# Altium project GSHT.PrjPCB
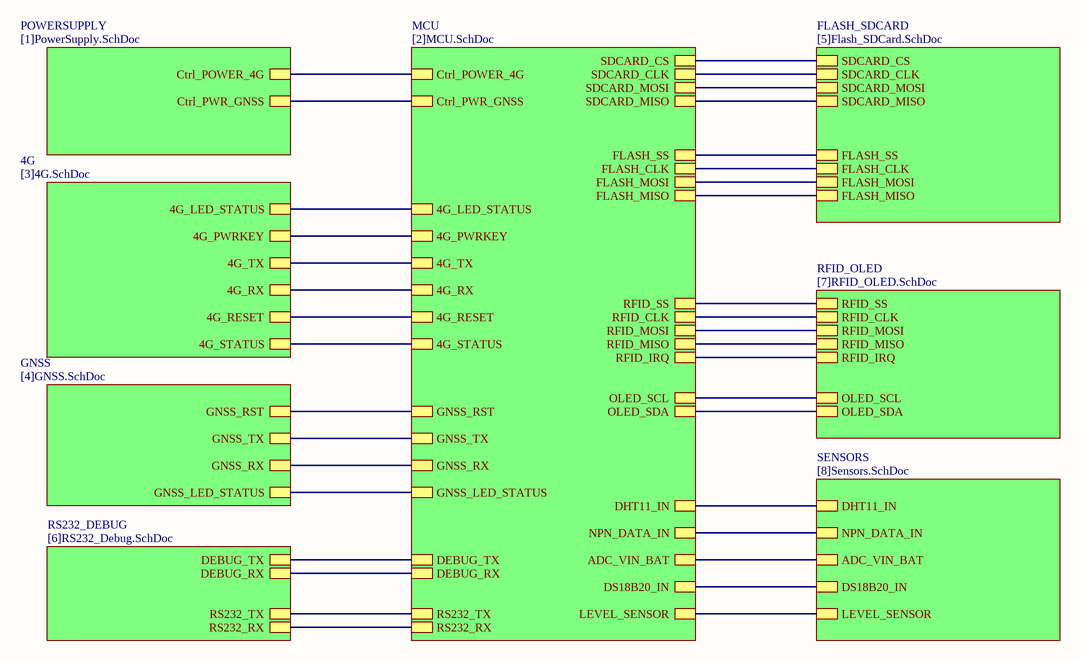
[diagram p0: MainSheet.SchDoc]
10 sheets, 215 parts. Net scope: hierarchical (ports join the sheet entries above them; power ports are global).
Board file: PCB_GSHT.PcbDoc
Sheets:
  MainSheet.SchDoc
    MCU = [2]MCU.SchDoc
    POWERSUPPLY = [1]PowerSupply.SchDoc
    4G = [3]4G.SchDoc
    GNSS = [4]GNSS.SchDoc
    FLASH_SDCARD = [5]Flash_SDCard.SchDoc
    RS232_DEBUG = [6]RS232_Debug.SchDoc
    RFID_OLED = [7]RFID_OLED.SchDoc
    SENSORS = [8]Sensors.SchDoc
  [0]Abstract.SchDoc

## Sheet MainSheet.SchDoc
size A

### Sub-sheets
4G = [3]4G.SchDoc: 4G_LED_STATUS, 4G_PWRKEY, 4G_TX, 4G_RX, 4G_RESET, 4G_STATUS
FLASH_SDCARD = [5]Flash_SDCard.SchDoc: SDCARD_CS, SDCARD_CLK, SDCARD_MISO, SDCARD_MOSI, FLASH_SS, FLASH_CLK, FLASH_MOSI, FLASH_MISO
GNSS = [4]GNSS.SchDoc: GNSS_RST, GNSS_TX, GNSS_RX, GNSS_LED_STATUS
MCU = [2]MCU.SchDoc: GNSS_LED_STATUS, 4G_LED_STATUS, GNSS_RST, GNSS_TX, GNSS_RX, 4G_TX, 4G_RX, 4G_STATUS, 4G_PWRKEY, RFID_IRQ, RS232_TX, RS232_RX, RFID_SS, RFID_CLK, RFID_MISO, RFID_MOSI, Ctrl_POWER_4G, Ctrl_PWR_GNSS, SDCARD_CS, DEBUG_TX, DEBUG_RX, SDCARD_CLK, SDCARD_MOSI, SDCARD_MISO, 4G_RESET, FLASH_SS, FLASH_CLK, FLASH_MOSI, FLASH_MISO, LEVEL_SENSOR, NPN_DATA_IN, ADC_VIN_BAT, DS18B20_IN, OLED_SCL, OLED_SDA, DHT11_IN
POWERSUPPLY = [1]PowerSupply.SchDoc: Ctrl_POWER_4G, Ctrl_PWR_GNSS
RFID_OLED = [7]RFID_OLED.SchDoc: RFID_SS, RFID_CLK, RFID_MOSI, RFID_MISO, RFID_IRQ, OLED_SCL, OLED_SDA
RS232_DEBUG = [6]RS232_Debug.SchDoc: RS232_TX, RS232_RX, DEBUG_TX, DEBUG_RX
SENSORS = [8]Sensors.SchDoc: NPN_DATA_IN, ADC_VIN_BAT, DS18B20_IN, LEVEL_SENSOR, DHT11_IN

### Nets
NetC39_1: sheet MCU/OLED_SDA, sheet RFID_OLED/OLED_SDA
NetC39_2: sheet MCU/OLED_SCL, sheet RFID_OLED/OLED_SCL
NetC70_1: sheet MCU/NPN_DATA_IN, sheet SENSORS/NPN_DATA_IN
NetC71_1: sheet MCU/ADC_VIN_BAT, sheet SENSORS/ADC_VIN_BAT
NetD3_1: sheet MCU/GNSS_LED_STATUS, sheet GNSS/GNSS_LED_STATUS
NetD3_3: sheet MCU/4G_LED_STATUS, sheet 4G/4G_LED_STATUS
NetIC4_1: sheet MCU/4G_TX, sheet 4G/4G_TX
NetIC4_8: sheet MCU/4G_RX, sheet 4G/4G_RX
NetIC6_2: sheet MCU/DS18B20_IN, sheet SENSORS/DS18B20_IN
NetJP1_1: sheet MCU/RFID_SS, sheet RFID_OLED/RFID_SS
NetJP1_2: sheet MCU/RFID_CLK, sheet RFID_OLED/RFID_CLK
NetJP1_3: sheet MCU/RFID_MOSI, sheet RFID_OLED/RFID_MOSI
NetJP1_4: sheet MCU/RFID_MISO, sheet RFID_OLED/RFID_MISO
NetJP1_5: sheet MCU/RFID_IRQ, sheet RFID_OLED/RFID_IRQ
NetJP3_2: sheet MCU/LEVEL_SENSOR, sheet SENSORS/LEVEL_SENSOR
NetJP4_2: sheet MCU/DHT11_IN, sheet SENSORS/DHT11_IN
NetLED5_2: sheet MCU/RS232_RX, sheet RS232_DEBUG/RS232_RX
NetLED6_2: sheet MCU/RS232_TX, sheet RS232_DEBUG/RS232_TX
NetLED7_2: sheet MCU/DEBUG_RX, sheet RS232_DEBUG/DEBUG_RX
NetLED8_2: sheet MCU/DEBUG_TX, sheet RS232_DEBUG/DEBUG_TX
NetR7_2: sheet MCU/Ctrl_POWER_4G, sheet POWERSUPPLY/Ctrl_POWER_4G
NetR11_2: sheet MCU/Ctrl_PWR_GNSS, sheet POWERSUPPLY/Ctrl_PWR_GNSS
NetR28_1: sheet MCU/4G_RESET, sheet 4G/4G_RESET
NetR34_1: sheet MCU/4G_PWRKEY, sheet 4G/4G_PWRKEY
NetR41_1: sheet MCU/GNSS_RST, sheet GNSS/GNSS_RST
NetR48_1: sheet MCU/SDCARD_CS, sheet FLASH_SDCARD/SDCARD_CS
NetR49_1: sheet MCU/SDCARD_MOSI, sheet FLASH_SDCARD/SDCARD_MOSI
NetR50_1: sheet MCU/SDCARD_CLK, sheet FLASH_SDCARD/SDCARD_CLK
NetR51_1: sheet MCU/SDCARD_MISO, sheet FLASH_SDCARD/SDCARD_MISO
NetR52_1: sheet MCU/FLASH_SS, sheet FLASH_SDCARD/FLASH_SS
NetR72_2: sheet MCU/4G_STATUS, sheet 4G/4G_STATUS
NetU3_34: sheet MCU/FLASH_CLK, sheet FLASH_SDCARD/FLASH_CLK
NetU3_35: sheet MCU/FLASH_MISO, sheet FLASH_SDCARD/FLASH_MISO
NetU3_36: sheet MCU/FLASH_MOSI, sheet FLASH_SDCARD/FLASH_MOSI
NetU3_51: sheet MCU/GNSS_TX, sheet GNSS/GNSS_TX
NetU3_52: sheet MCU/GNSS_RX, sheet GNSS/GNSS_RX

## Sheet [2]MCU.SchDoc
size A4
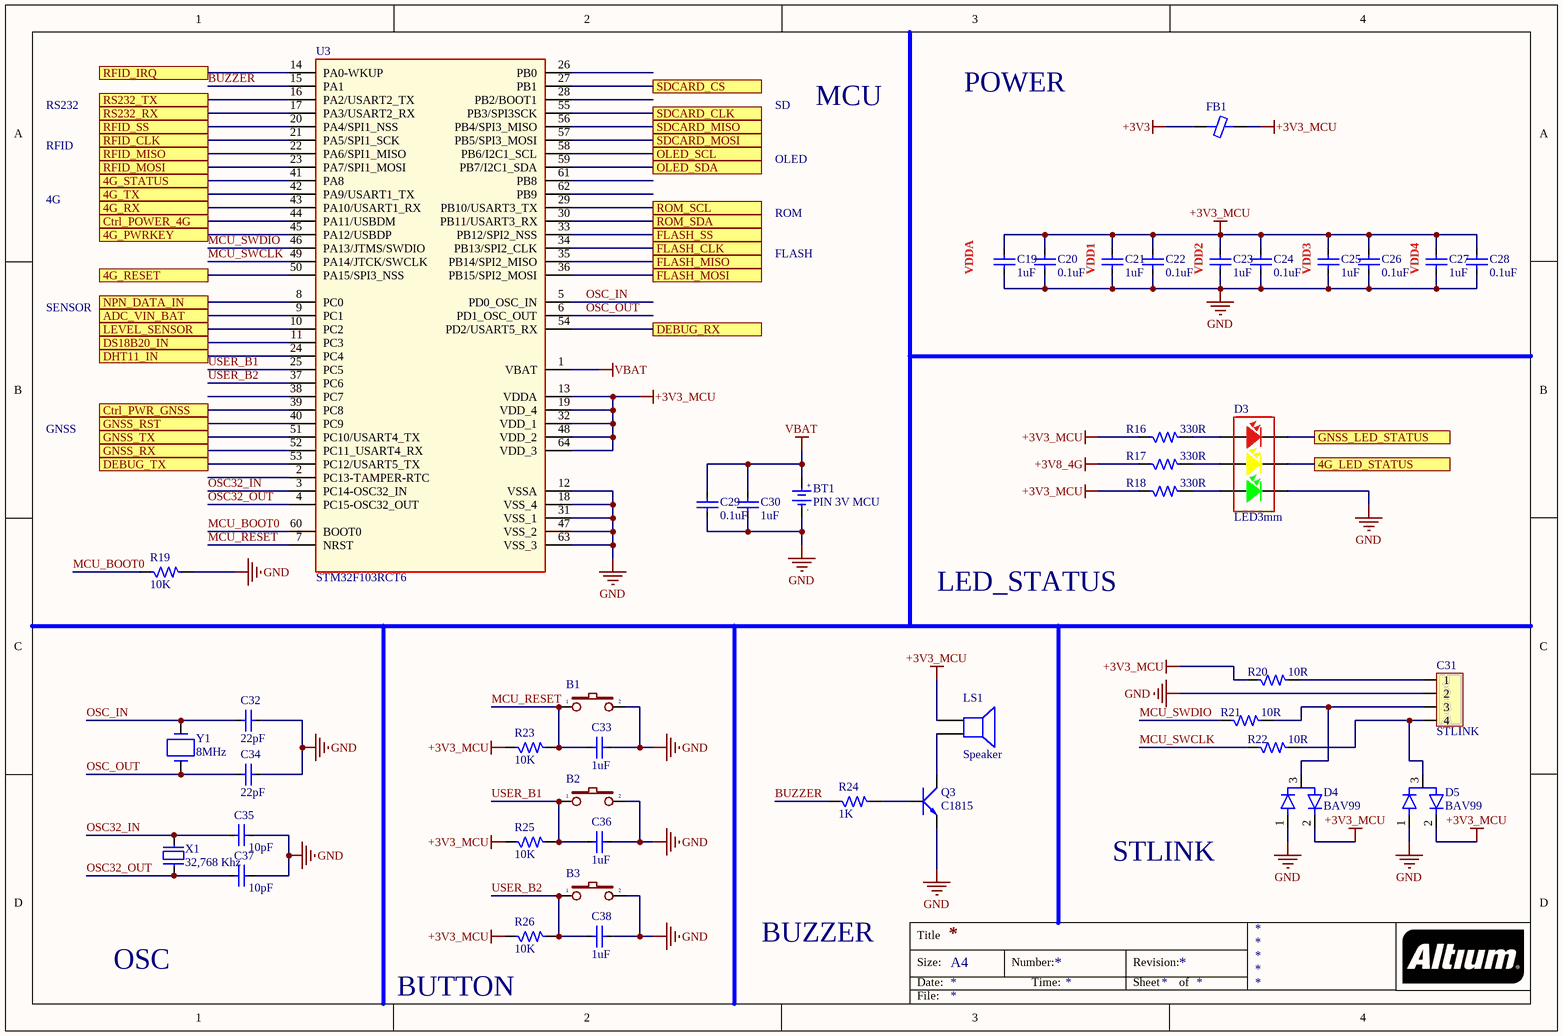
[diagram p1: [2]MCU.SchDoc]

### Parts
B1  Button 3x4x2.5  [Button 3x4x2.5]  (value not drawn)
B2  Button 3x4x2.5  [Button 3x4x2.5]  (value not drawn)
B3  Button 3x4x2.5  [Button 3x4x2.5]  (value not drawn)
BT1  PIN 3V MCU  [CR1220 SMD]
C19  1uF  [CAP_0805]
C20  0.1uF  [CAP_0805]
C21  1uF  [CAP_0805]
C22  0.1uF  [CAP_0805]
C23  1uF  [CAP_0805]
C24  0.1uF  [CAP_0805]
C25  1uF  [CAP_0805]
C26  0.1uF  [CAP_0805]
C27  1uF  [CAP_0805]
C28  0.1uF  [CAP_0805]
C29  0.1uF  [CAP_0805]
C30  1uF  [CAP_0805]
C31  STLINK  [CON_4P]
C32  22pF  [CAP_0805]
C33  1uF  [CAP_0805]
C34  22pF  [CAP_0805]
C35  10pF  [CAP_0805]
C36  1uF  [CAP_0805]
C37  10pF  [CAP_0805]
C38  1uF  [CAP_0805]
D3  LED3mm  [LED 3 holder 3mm]
D4  BAV99  [DIO_BAV99]
D5  BAV99  [DIO_BAV99]
FB1  120R  [RES-SMD-0805]  (value not drawn)
LS1  Speaker  [SPEAKER]
Q3  C1815  [SOT23B]
R16  330R  [R0805]
R17  330R  [R0805]
R18  330R  [R0805]
R19  10K  [R0805]
R20  10R  [R0805]
R21  10R  [R0805]
R22  10R  [R0805]
R23  10K  [R0805]
R24  1K  [R0805]
R25  10K  [R0805]
R26  10K  [R0805]
U3  STM32F103RCT6  [LQFP-64]
X1  32,768 Khz  [XT32kn]
Y1  8MHz  [ABM7_v1_1_BIG]

### Ports
4G_LED_STATUS, 4G_PWRKEY, 4G_RESET, 4G_RX, 4G_STATUS, 4G_TX, ADC_VIN_BAT, Ctrl_POWER_4G, Ctrl_PWR_GNSS, DEBUG_RX, DEBUG_TX, DHT11_IN, DS18B20_IN, FLASH_CLK, FLASH_MISO, FLASH_MOSI, FLASH_SS, GNSS_LED_STATUS, GNSS_RST, GNSS_RX, GNSS_TX, LEVEL_SENSOR, NPN_DATA_IN, OLED_SCL, OLED_SDA, RFID_CLK, RFID_IRQ, RFID_MISO, RFID_MOSI, RFID_SS, ROM_SCL, ROM_SDA, RS232_RX, RS232_TX, SDCARD_CLK, SDCARD_CS, SDCARD_MISO, SDCARD_MOSI

### Nets
+3V3: FB1.1
+3V3_MCU: C19.2 C20.2 C21.2 C22.2 C23.2 C24.2 C25.2 C26.2 C27.2 C28.2 D4.2 D5.2 FB1.2 LS1.1 R16.1 R18.1 R20.1 R23.1 R25.1 R26.1 U3.13(VDDA) U3.19(VDD_4) U3.32(VDD_1) U3.48(VDD_2) U3.64(VDD_3)
+3V8_4G: R17.1
GND: B1.2 B2.2 B3.2 BT1.2(GND) C19.1 C20.1 C21.1 C22.1 C23.1 C24.1 C25.1 C26.1 C27.1 C28.1 C29.1 C30.1 C31.2 C32.1 C33.1 C34.1 C35.1 C36.1 C37.1 C38.1 D3.5 D4.1 D5.1 Q3.1(E) R19.2 U3.12(VSSA) U3.18(VSS_4) U3.31(VSS_1) U3.47(VSS_2) U3.63(VSS_3)
VBAT: BT1.1(+3V) C29.2 C30.2 U3.1(VBAT)
BUZZER: R24.1 U3.15(PA1)
MCU_BOOT0: R19.1 U3.60(BOOT0)
MCU_RESET: B1.1 C33.2 R23.2 U3.7(NRST)
MCU_SWCLK: R22.1 U3.49(PA14/JTCK/SWCLK)
MCU_SWDIO: R21.1 U3.46(PA13/JTMS/SWDIO)
OSC32_IN: C35.2 U3.3(PC14-OSC32_IN) X1.1
OSC32_OUT: C37.2 U3.4(PC15-OSC32_OUT) X1.2
OSC_IN: C32.2 U3.5(PD0_OSC_IN) Y1.2
OSC_OUT: C34.2 U3.6(PD1_OSC_OUT) Y1.1
USER_B1: B2.1 C36.2 R25.2 U3.25(PC5)
USER_B2: B3.1 C38.2 R26.2 U3.37(PC6)
NetC31_1: C31.1 R20.2
NetC31_3: C31.3 D4.3 R21.2
NetC31_4: C31.4 D5.3 R22.2
NetC39_1: U3.59(PB7/I2C1_SDA) ; port OLED_SDA
NetC39_2: U3.58(PB6/I2C1_SCL) ; port OLED_SCL
NetC70_1: U3.8(PC0) ; port NPN_DATA_IN
NetC71_1: U3.9(PC1) ; port ADC_VIN_BAT
NetD3_1: D3.1 ; port GNSS_LED_STATUS
NetD3_2: D3.2 R16.2
NetD3_3: D3.3 ; port 4G_LED_STATUS
NetD3_4: D3.4 R17.2
NetD3_6: D3.6 R18.2
NetIC4_1: U3.42(PA9/USART1_TX) ; port 4G_TX
NetIC4_8: U3.43(PA10/USART1_RX) ; port 4G_RX
NetIC6_2: U3.11(PC3) ; port DS18B20_IN
NetJP1_1: U3.20(PA4/SPI1_NSS) ; port RFID_SS
NetJP1_2: U3.21(PA5/SPI1_SCK) ; port RFID_CLK
NetJP1_3: U3.23(PA7/SPI1_MOSI) ; port RFID_MOSI
NetJP1_4: U3.22(PA6/SPI1_MISO) ; port RFID_MISO
NetJP1_5: U3.14(PA0-WKUP) ; port RFID_IRQ
NetJP3_2: U3.10(PC2) ; port LEVEL_SENSOR
NetJP4_2: U3.24(PC4) ; port DHT11_IN
NetLED5_2: U3.17(PA3/USART2_RX) ; port RS232_RX
NetLED6_2: U3.16(PA2/USART2_TX) ; port RS232_TX
NetLED7_2: U3.54(PD2/USART5_RX) ; port DEBUG_RX
NetLED8_2: U3.53(PC12/USART5_TX) ; port DEBUG_TX
NetLS1_2: LS1.2 Q3.2(C)
NetQ3_3: Q3.3(B) R24.2
NetR7_2: U3.44(PA11/USBDM) ; port Ctrl_POWER_4G
NetR11_2: U3.39(PC8) ; port Ctrl_PWR_GNSS
NetR28_1: U3.50(PA15/SPI3_NSS) ; port 4G_RESET
NetR34_1: U3.45(PA12/USBDP) ; port 4G_PWRKEY
NetR41_1: U3.40(PC9) ; port GNSS_RST
NetR48_1: U3.27(PB1) ; port SDCARD_CS
NetR49_1: U3.57(PB5/SPI3_MOSI) ; port SDCARD_MOSI
NetR50_1: U3.55(PB3/SPI3SCK) ; port SDCARD_CLK
NetR51_1: U3.56(PB4/SPI3_MISO) ; port SDCARD_MISO
NetR52_1: U3.33(PB12/SPI2_NSS) ; port FLASH_SS
NetR72_2: U3.41(PA8) ; port 4G_STATUS
NetU3_29: U3.29(PB10/USART3_TX) ; port ROM_SCL
NetU3_30: U3.30(PB11/USART3_RX) ; port ROM_SDA
NetU3_34: U3.34(PB13/SPI2_CLK) ; port FLASH_CLK
NetU3_35: U3.35(PB14/SPI2_MISO) ; port FLASH_MISO
NetU3_36: U3.36(PB15/SPI2_MOSI) ; port FLASH_MOSI
NetU3_51: U3.51(PC10/USART4_TX) ; port GNSS_TX
NetU3_52: U3.52(PC11_USART4_RX) ; port GNSS_RX

Not connected (* = marked no-connect by the designer): U3 2(PC13-TAMPER-RTC) 26(PB0) 28(PB2/BOOT1) 38(PC7) 61(PB8) 62(PB9)

### Notes on the sheet
- RS232
- SD
- MCU
- POWER
- RFID
- OLED
- 4G
- ROM
- SENSOR
- FLASH
- (near C19) VDDA
- (near C21) VDD1
- (near C23) VDD2
- (near C25) VDD3
- (near C27) VDD4
- GNSS
- LED_STATUS
- STLINK
- OSC
- BUZZER
- (near R26) BUTTON
- Title
- Size:
- Date:
- A4
- Number:
- Time:
- Revision:
- Sheet
- of
- File:
- (in symbol PIN 3V) +; -

### Library data of the parts
B1-B3 = Button 3x4x2.5: pin to pad: 1>15 2>19
BT1 = PIN 3V: Battery 3VDC; Value: PIN 3V
C19-C30 C32-C38 = CapSMD: Capacitor; Value: 33p; Published: 8-Jun-2000; LatestRevisionDate: 17-Jul-2002; LatestRevisionNote: Re-released for DXP Platform.; PackageReference: RAD-0.3; Publisher: Altium Limited
C31 = Header4: Header IDC, 4 x 1 Pin Vertical 2.54mm Pitch (Non-Boxed, Male); Manufacturer: W¨¹rth Elektronik eiSos GmbH; partNo: 613002143121; ComponentLink1 Description: Manufacturer; ComponentLink2 Description: Datasheet; NoPins: 02; Created Date: 29 March 2013; ComponentLink1URL: http://www.we-online.com; ComponentLink2URL: http://katalog.we-online.de/em/datasheet/6130xx143121.pdf; Created by: Karrer Zheng
D3 = LED3Holder_3: LED 3 holder RGB 3mm; Value: LED 3 ly Single Colour
D4 D5 = BAV99: Diode Array 1 Pair Series Connection Standard 100V 215mA (DC) Surface Mount TO-236-3, SC-59, SOT-23-3; MF: ON Semiconductor; Price: None; Availability: In Stock; MP: BAV99; Package: SOT-23-3 Motorola; SnapEDA_Link: https://www.snapeda.com/parts/BAV99/Onsemi/view-part/?ref=snap; Check_prices: https://www.snapeda.com/parts/BAV99/Onsemi/view-part/?ref=eda; Value: *; Purchase-URL: https://pricing.snapeda.com/search/part/BAV99/?ref=eda
FB1 = Ferrite beads
LS1 = Speaker: Loudspeaker; Published: 24-Mar-1999; LatestRevisionDate: 17-Jul-2002; LatestRevisionNote: Re-released for DXP Platform.; PackageReference: PIN2; Publisher: Altium Limited
Q3 = C1815: NPN 600mW, ECB; Value: C1815
R16-R23 R25 R26 = RM: Resistor SMD; Value: 1K
R24 = RM: Resistor SMD; Value: 1K
U3 = STM32F103RCT6: MCU 32BIT 256KB FLASH 64LQFP
X1 = XT32k: Crystal 32,768kHz for timer real; Value: 32,768khz
Y1 = ABM7-16.000MHZ-D2Y-T: CRYSTAL 16MHZ 18PF SMD; Manufacturer: Abracon LLC; Frequency Stability: ±30ppm; Frequency Tolerance: ±20ppm; ESR (Equivalent Series Resistance): 50 Ohm; Operating Mode: Fundamental; .Creator: MM; .Checked PCB: RF; Supplier 1: Digi-Key; Manufacturer Part Number: ABM7-16.000MHZ-D2Y-T; RoHS: RoHS Compliant; Category: Crystals and Oscillators; Stock 1: 5861; Pricing 1: 1=0.96, 10=0.847, 50=0.791, 100=0.7, 500=0.6615 (USD); Packaging: Cut Tape (CT); Type: MHz Crystal; Frequency: 16MHz; Load Capacitance: 18pF; Operating Temperature: -40°C ~ 85°C; Ratings: -; Mounting Type: Surface Mount; Package / Case: 2-SMD; Size / Dimension: 0.236" L x 0.138" W (6.00mm x 3.50mm); Height: 0.055" (1.40mm); ComponentLink1URL: http://www.abracon.com/Resonators/abm7.pdf; ComponentLink1Description: http://www.abracon.com/Resonators/abm7.pdf; Supplier Part Number 1: 535-9840-1-ND; .Checked SCH: RF

## Sheet [1]PowerSupply.SchDoc
size A4
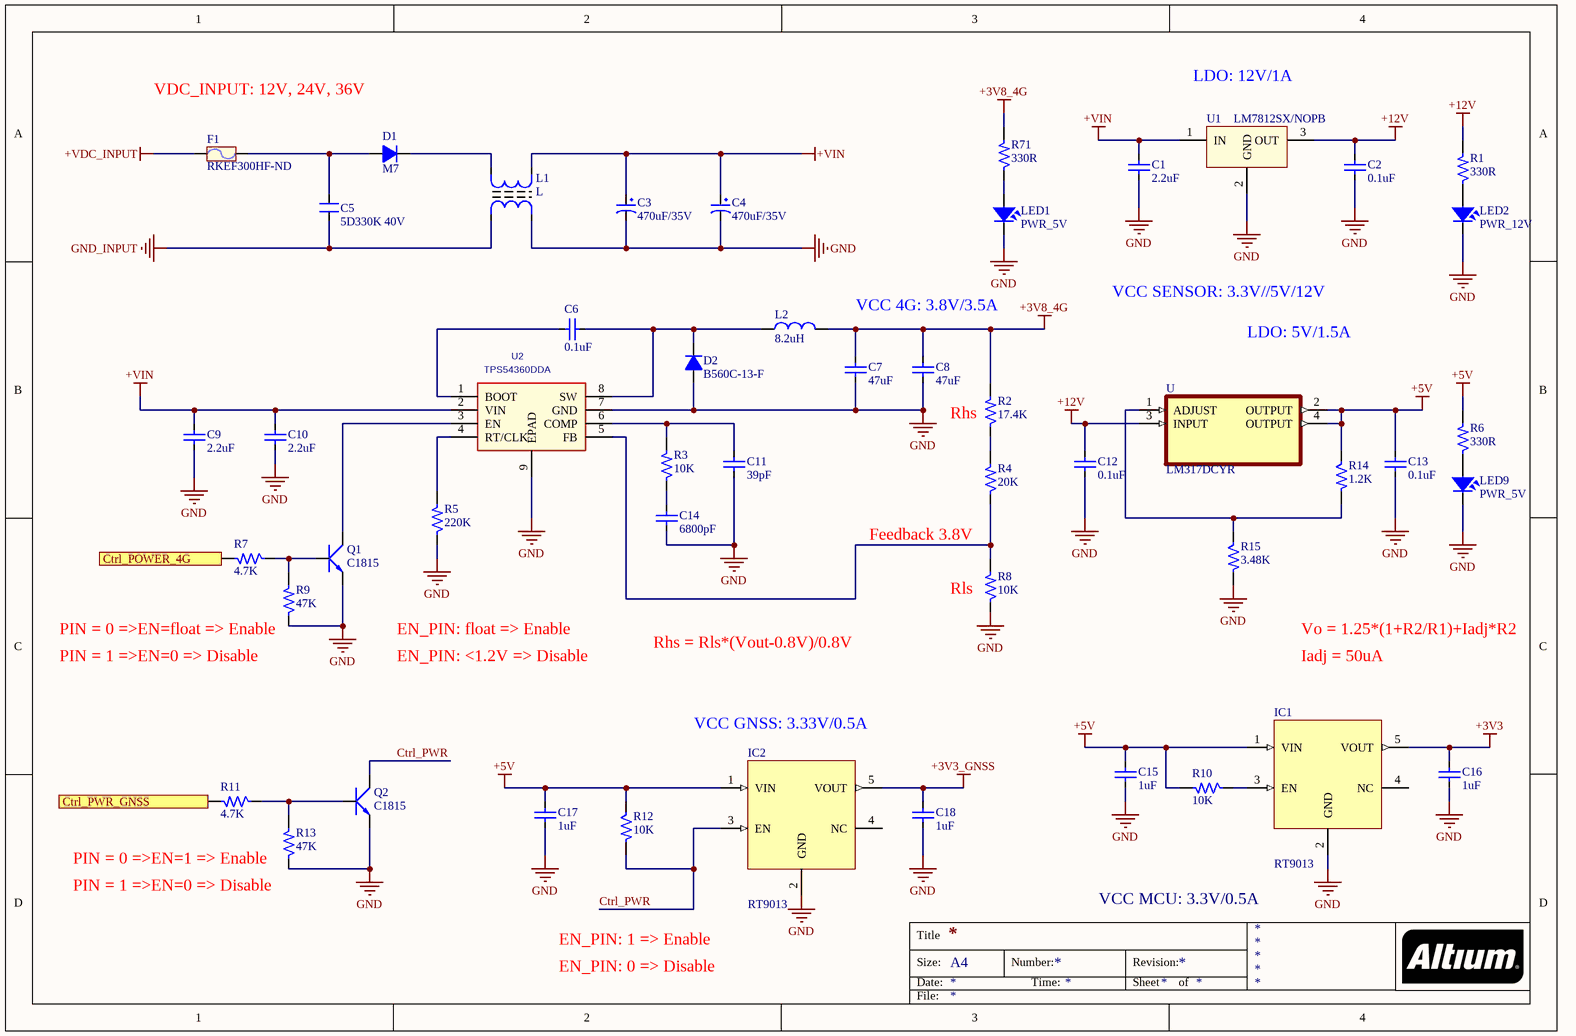
[diagram p2: [1]PowerSupply.SchDoc]

### Parts
C1  2.2uF  [CAP_0805]
C2  0.1uF  [CAP_0805]
C3  470uF/35V  [C10mm]
C4  470uF/35V  [C10mm]
C5  5D330K 40V  [CN2]
C6  0.1uF  [CAP_0805]
C7  47uF  [CAP_0805]
C8  47uF  [CAP_0805]
C9  2.2uF  [CAP_0805]
C10  2.2uF  [CAP_0805]
C11  39pF  [CAP_0805]
C12  0.1uF  [CAP_0805]
C13  0.1uF  [CAP_0805]
C14  6800pF  [CAP_0805]
C15  1uF  [CAP_0805]
C16  1uF  [CAP_0805]
C17  1uF  [CAP_0805]
C18  1uF  [CAP_0805]
D1  M7  [SMA11]
D2  B560C-13-F  [DO-214AB SMC]
F1  RKEF300HF-ND  [FUSE2]
IC1  RT9013  [SOT23-5]
IC2  RT9013  [SOT23-5]
L1  L  [L2 UF9.8]
L2  8.2uH  [L01 SMD 12*12*6]
LED1  PWR_5V  [LED-0805-Blue]
LED2  PWR_12V  [LED-0805-Blue]
LED9  PWR_5V  [LED-0805-Blue]
Q1  C1815  [SOT23B]
Q2  C1815  [SOT23B]
R1  330R  [R0805]
R2  17.4K  [R0805]
R3  10K  [R0805]
R4  20K  [R0805]
R5  220K  [R0805]
R6  330R  [R0805]
R7  4.7K  [R0805]
R8  10K  [R0805]
R9  47K  [R0805]
R10  10K  [R0805]
R11  4.7K  [R0805]
R12  10K  [R0805]
R13  47K  [R0805]
R14  1.2K  [R0805]
R15  3.48K  [R0805]
R71  330R  [R0805]
U  LM317DCYR  [SOT230P700X180-4N]
U1  LM7812SX/NOPB  [QTO-220]
U2  TPS54360DDA  [DDA8_3P1X2P4-M]

### Ports
Ctrl_POWER_4G, Ctrl_PWR_GNSS

### Nets
+3V3: C16.2 IC1.5(VOUT)
+3V3_GNSS: C18.2 IC2.5(VOUT)
+3V8_4G: C7.2 C8.2 L2.2 R2.2 R71.2
+5V: C13.2 C15.2 C17.2 IC1.1(VIN) IC2.1(VIN) R6.2 R10.2 R12.1 R14.1 U.2(OUTPUT) U.4(OUTPUT)
+12V: C2.2 C12.2 R1.2 U.3(INPUT) U1.3(OUT)
+VDC_INPUT: F1.1
+VIN: C1.2 C3.1 C4.1 C9.2 C10.2 L1.3 U1.1(IN) U2.2(VIN)
GND: C1.1 C2.1 C3.2 C4.2 C7.1 C8.1 C9.1 C10.1 C11.1 C12.1 C13.1 C14.1 C15.1 C16.1 C17.1 C18.1 D2.1(A) IC1.2(GND) IC2.2(GND) L1.2 LED1.2 LED2.2 LED9.2 Q1.1(E) Q2.1(E) R5.1 R8.1 R9.1 R13.1 R15.2 U1.2(GND) U2.7(GND) U2.9(EPAD)
GND_INPUT: C5.1 L1.1
Ctrl_PWR: IC2.3(EN) Q2.2(C) R12.2
NetC5_2: C5.2 D1.1(A) F1.2
NetC6_1: C6.1 D2.2(K) L2.1 U2.8(SW)
NetC6_2: C6.2 U2.1(BOOT)
NetC11_2: C11.2 R3.2 U2.6(COMP)
NetC14_2: C14.2 R3.1
NetD1_2: D1.2(K) L1.4
NetIC1_3: IC1.3(EN) R10.1
NetLED1_1: LED1.1 R71.1
NetLED2_1: LED2.1 R1.1
NetLED9_1: LED9.1 R6.1
NetQ1_2: Q1.2(C) U2.3(EN)
NetQ1_3: Q1.3(B) R7.1 R9.2
NetQ2_3: Q2.3(B) R11.1 R13.2
NetR2_1: R2.1 R4.2
NetR4_1: R4.1 R8.2 U2.5(FB)
NetR5_2: R5.2 U2.4(RT/CLK)
NetR7_2: R7.2 ; port Ctrl_POWER_4G
NetR11_2: R11.2 ; port Ctrl_PWR_GNSS
NetR14_2: R14.2 R15.1 U.1(ADJUST)

Not connected (* = marked no-connect by the designer): IC1 4(NC); IC2 4(NC)

### Notes on the sheet
- VDC_INPUT: 12V, 24V, 36V
- LDO: 12V/1A
- VCC 4G: 3.8V/3.5A
- VCC SENSOR: 3.3V//5V/12V
- LDO: 5V/1.5A
- (near R2) Rhs
- Feedback 3.8V
- (near R9) PIN = 0 =>EN=float => Enable
- EN_PIN: float => Enable
- Rhs = Rls*(Vout-0.8V)/0.8V
- (near R8) Rls
- Vo = 1.25*(1+R2/R1)+Iadj*R2
- (near R9) PIN = 1 =>EN=0 => Disable
- EN_PIN: <1.2V => Disable
- Iadj = 50uA
- VCC GNSS: 3.33V/0.5A
- (near R13) PIN = 1 =>EN=0 => Disable
- (near R13) PIN = 0 =>EN=1 => Enable
- VCC MCU: 3.3V/0.5A
- EN_PIN: 1 => Enable
- EN_PIN: 0 => Disable
- Title
- Size:
- Date:
- A4
- Number:
- Time:
- Revision:
- Sheet
- of
- File:

### Library data of the parts
C1 C2 C6-C18 = CapSMD: Capacitor; Value: 33p; Published: 8-Jun-2000; LatestRevisionDate: 17-Jul-2002; LatestRevisionNote: Re-released for DXP Platform.; PackageReference: RAD-0.3; Publisher: Altium Limited
C3 C4 = CP4: Cap 1000uF/16V - 220uF/50V; Description 5: 4,7uF>10uF/250V_3,3uF>10uF/400V - 2,2uF>4,7uF/450V; Description 1: 2200uF-3300uF/6,3V - 1000uF-2200uF/10V; Description 2: 1000uF/16V - 470uF => 1000uF/25V - 100uF/100V; Description 3: 330uF>470uF/35V_220uF>470uF/50V_10uF>22uF/250V; Description 4: 220uF => 330uF/63V - 10uF =>33uF/160 - 200V; Value: 1000uF/16V
C5 = CN: 5D330K 33V; Value: 0,1uF/300V; Designed by: VanDungEvn
D1 = D1A: Diode 1A; Value: 1N4007
D2 = D5A: DIODE SCHOTTKY 60V 5A SMC; Value: 1N5408
F1 = Fuse: PTC RESET FUSE 60V 3A RADIAL; Designed by: VanDungEvn; Value: Fuse
IC1 IC2 = RT9013: RT9013-33GB IC REG LINEAR 3.3V 500mA SOT23-5
L1 = L2x220: Inductor; Value: Loc 220; Designed by: VanDungEvn
L2 = L1: FIXED IND 6.2UH 5.7A 22.4 MOHM; Value: 150 mH
LED1 LED2 LED9 = LED: LED Single colour Green and Red; Value: LED 3 ly Single Colour
Q1 Q2 = C1815: NPN 600mW, ECB; Value: C1815
R1-R15 R71 = RM: Resistor SMD; Value: 1K
U = LM317DCYR: 1.5-A, 40-V, adjustable linear voltage regulator 4-SOT-223 0 to 125; MF: Texas Instruments; Texas_Instruments-Purchase-URL: https://snapeda.com/shop?store=Texas+Instruments&id=215192; SnapEDA_Link: https://www.snapeda.com/parts/LM317DCYR/Texas%20Instruments/view-part/215192/?ref=snap; Availability: Unavailable; DigiKey-Purchase-URL: https://snapeda.com/shop?store=DigiKey&id=215192; Package: SOT-223-4 Texas Instruments; Value: *; Price: None; Mouser-Purchase-URL: https://snapeda.com/shop?store=Mouser&id=215192; MP: LM317DCYR
U1 = LM78xx_1: Value: LM7805
U2 = TPS54360DDA: REG BUCK SPLIT RAIL 8SOPWRPAD; C: Copyright (C) 2015 Accelerated Designs. All rights reserved; Vendor: TEXAS INSTRUMENTS; Built_By: EMA_UL_Team; Value: TPS54360DDA; Manufacturer_Part_Number: TPS54360DDA

## Sheet [3]4G.SchDoc
size A4
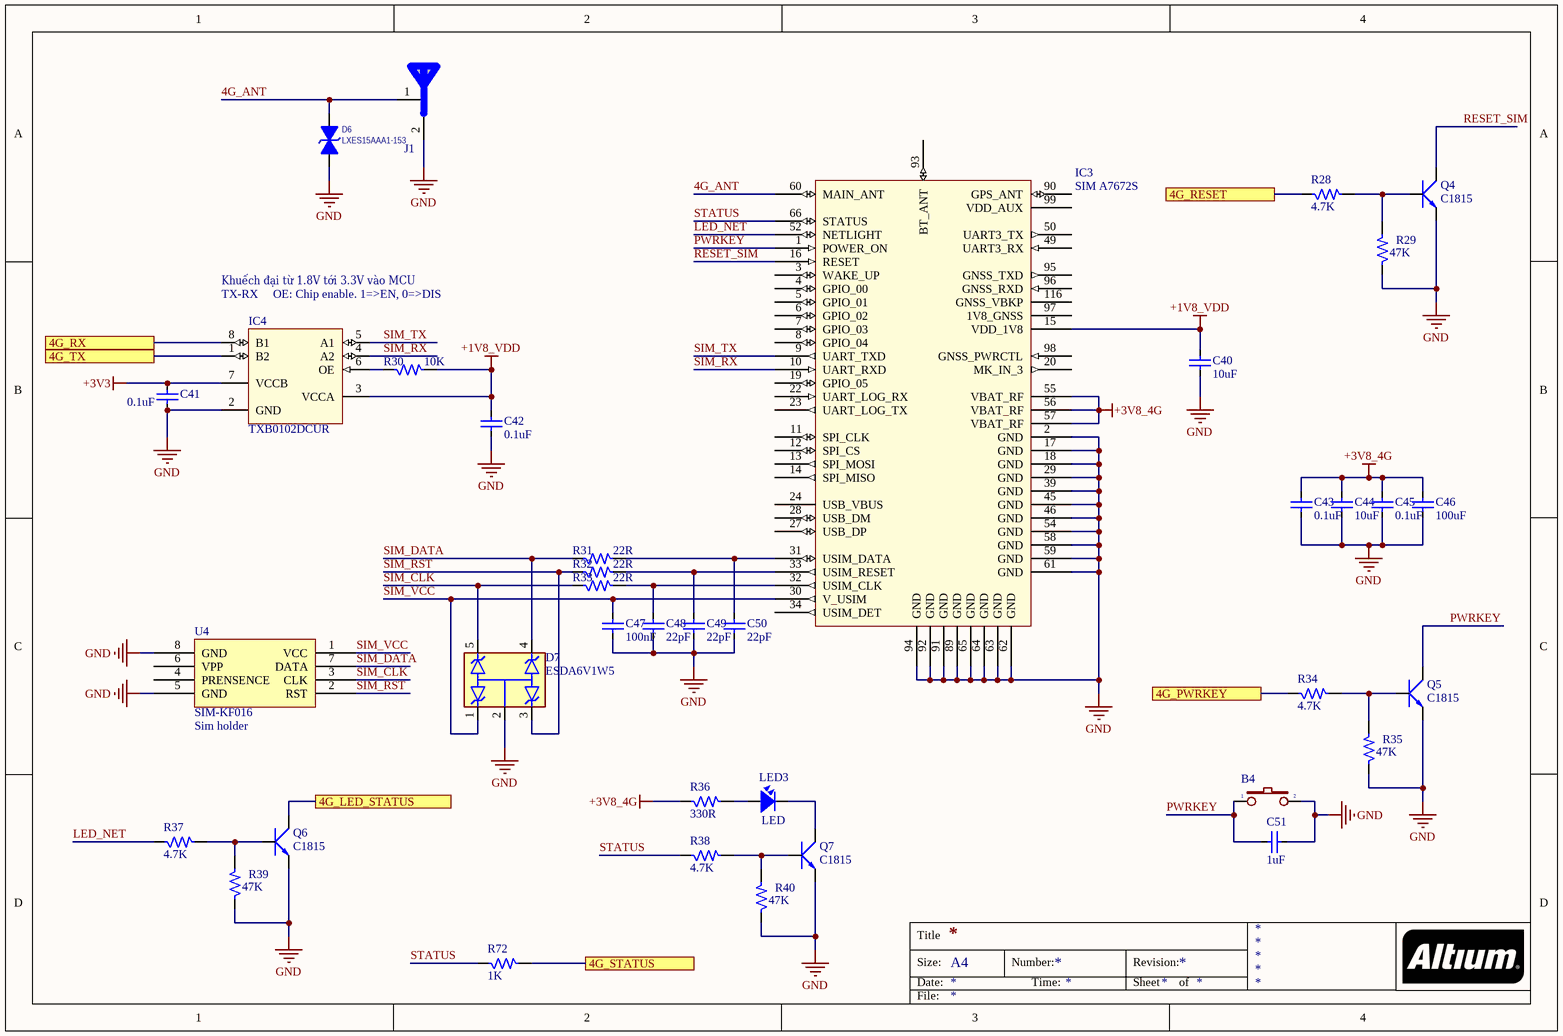
[diagram p3: [3]4G.SchDoc]

### Parts
B4  Button 3x4x2.5  [Button 3x4x2.5]  (value not drawn)
C40  10uF  [CAP_0805]
C41  0.1uF  [CAP_0805]
C42  0.1uF  [CAP_0805]
C43  0.1uF  [CAP_0805]
C44  10uF  [CAP_0805]
C45  0.1uF  [CAP_0805]
C46  100uF  [CAP_0805]
C47  100nF  [CAP_0805]
C48  22pF  [CAP_0805]
C49  22pF  [CAP_0805]
C50  22pF  [CAP_0805]
C51  1uF  [CAP_0805]
D6  LXES15AAA1-153  [R-0402]
D7  ESDA6V1W5  [SOT65P210X110-5N]
IC3  SIM A7672S  [SIM A7672S]
IC4  TXB0102DCUR  [US8]
J1  GPS  [Antenna-MCX5.08-H5]  (value not drawn)
LED3  LED  [LED-0805-Red]
Q4  C1815  [SOT23B]
Q5  C1815  [SOT23B]
Q6  C1815  [SOT23B]
Q7  C1815  [SOT23B]
R28  4.7K  [R0805]
R29  47K  [R0805]
R30  10K  [R0805]
R31  22R  [R0805]
R32  22R  [R0805]
R33  22R  [R0805]
R34  4.7K  [R0805]
R35  47K  [R0805]
R36  330R  [R0805]
R37  4.7K  [R0805]
R38  4.7K  [R0805]
R39  47K  [R0805]
R40  47K  [R0805]
R72  1K  [R0805]
U4  SIM-KF016  value Sim holder  [Sim Socket]

### Ports
4G_LED_STATUS, 4G_PWRKEY, 4G_RESET, 4G_RX, 4G_STATUS, 4G_TX

### Nets
+1V8_VDD: C40.2 C42.2 IC3.15(RESERVED) IC4.3(VCCA) R30.2
+3V3: C41.2 IC4.7(VCCB)
+3V8_4G: C43.2 C44.2 C45.2 C46.2 IC3.55(VBAT_RF) IC3.56(VBAT_RF) IC3.57(VBAT_RF) R36.1
GND: B4.2 C40.1 C41.1 C42.1 C43.1 C44.1 C45.1 C46.1 C47.1 C48.1 C49.1 C50.1 C51.1 D6.2(K) D7.2 IC3.2(GND) IC3.17(GND) IC3.18(GND) IC3.29(KEYPAD_0) IC3.39(GND) IC3.45(GND) IC3.46(ADC2) IC3.54(GPIO4) IC3.58(GND) IC3.59(GND) IC3.61(GND) IC3.62(GND) IC3.63(GND) IC3.64(GND) IC3.65(GND) IC3.89(GND) IC3.91(GND) IC3.92(GND) IC3.94(GND) IC4.2(GND) J1.2(GND) Q4.1(E) Q5.1(E) Q6.1(E) Q7.1(E) R29.1 R35.1 R39.1 R40.1 U4.5(GND) U4.8(GND)
4G_ANT: D6.1(A) IC3.60(MAIN_ANT) J1.1(GND)
LED_NET: IC3.52(GPIO41) R37.1
PWRKEY: B4.1 C51.2 IC3.1(POWER_ON) Q5.2(C)
RESET_SIM: IC3.16(RESERVED) Q4.2(C)
SIM_CLK: D7.5 R33.1 U4.3(CLK)
SIM_DATA: D7.4 R31.1 U4.7(DATA)
SIM_RST: D7.3 R32.1 U4.2(RST)
SIM_RX: IC3.10(UART_RXD) IC4.4(A2)
SIM_TX: IC3.9(UART_TXD) IC4.5(A1)
SIM_VCC: C47.2 D7.1 IC3.30(KEYPAD_2) U4.1(VCC)
STATUS: IC3.66(STATUS) R38.1 R72.1
NetC48_2: C48.2 IC3.32(KEYSENSE_N3) R33.2
NetC49_2: C49.2 IC3.33(KEYPAD_1) R32.2
NetC50_2: C50.2 IC3.31(KEYSENSE_N2) R31.2
NetD3_3: Q6.2(C) ; port 4G_LED_STATUS
NetIC4_1: IC4.1(B2) ; port 4G_TX
NetIC4_6: IC4.6(OE) R30.1
NetIC4_8: IC4.8(B1) ; port 4G_RX
NetLED3_1: LED3.1 R36.2
NetLED3_2: LED3.2 Q7.2(C)
NetQ4_3: Q4.3(B) R28.2 R29.2
NetQ5_3: Q5.3(B) R34.2 R35.2
NetQ6_3: Q6.3(B) R37.2 R39.2
NetQ7_3: Q7.3(B) R38.2 R40.2
NetR28_1: R28.1 ; port 4G_RESET
NetR34_1: R34.1 ; port 4G_PWRKEY
NetR72_2: R72.2 ; port 4G_STATUS

Not connected (* = marked no-connect by the designer): IC3 3(WAKE_UP) 4(GPIO_00) 5(GPIO_01) 6(GPIO_02) 7(GPIO_03) 8(GPIO_04) 11(SPI_CLK) 12(SPI_CS) 13(SPI_MOSI) 14(SPI_MISO) 19(GPIO_05) 20(MK_IN_3) 21(SPK_M) 22(SPK_P) 23(MIC1P) 24(MIC1N) 25(EAR1N) 26(EAR1P) 27(KEYSENSE_N1) 28(KEYSENSE_N0) 34(KEYPAD_4) 35(KEYPAD_3) 36(KEYSENSE_N4) 47(ADC1) 48(GPIO44) 49(GPIO40) 50(GPIO43) 51(GPIO1) 53(GPIO42) 73(PCM_DOUT) 74(PCM_DIN) 75(PCM_SYNC) 76(PCM_CLK) 90(GPS_ANT) 93(BT_ANT) 95(GNSS_TXD) 96(GNSS_RXD) 97(1V8_GNSS) 98(GNSS_PWRCTL) 99(VDD_AUX) 116(GNSS_VBKP); U4 4(PRENSENCE) 6(VPP)

### Notes on the sheet
- Khuếch đại từ 1.8V tới 3.3V vào MCU
- (near IC4) TX-RX     OE: Chip enable. 1=>EN, 0=>DIS
- Title
- Size:
- Date:
- A4
- Number:
- Time:
- Revision:
- Sheet
- of
- File:

### Library data of the parts
B4 = Button 3x4x2.5: pin to pad: 1>15 2>19
C40-C51 = CapSMD: Capacitor; Value: 33p; Published: 8-Jun-2000; LatestRevisionDate: 17-Jul-2002; LatestRevisionNote: Re-released for DXP Platform.; PackageReference: RAD-0.3; Publisher: Altium Limited
D6 = TVS: TVS DIODE 4VWM 1005; Manufacturer: Murata Electronics; Value: 4V; Category: Circuit Protection; Package: 0402; Part number: LXES15AAA1-153; User_Description: TVS DIODE 4VWM 1005
D7 = ESDA6V1W5: - Clamp - Ipp Tvs Diode Surface Mount SOT-323-5; MF: STMicroelectronics; SnapEDA_Link: https://www.snapeda.com/parts/ESDA6V1W5/STMicroelectronics/view-part/?ref=snap; Availability: In Stock; Price: None; Value: *; Check_prices: https://www.snapeda.com/parts/ESDA6V1W5/STMicroelectronics/view-part/?ref=eda; Purchase-URL: https://pricing.snapeda.com/search/part/ESDA6V1W5/?ref=eda; MP: ESDA6V1W5; Package: SOT-323 STMicroelectronics
IC3 = SIM A7672S: SIM A7672S-CAT-M1; Part number: SIM A7672S
IC4 = TXB0102DCUR: IC TRNSLTR BIDIRECTIONAL US8; Manufacturer: Texas Instruments; Category: IC Logic Level; Package: 8-VSSOP; Part number: TXB0102DCUR; User_Description: IC TRNSLTR BIDIRECTIONAL US8
J1 = ANTEN
LED3 = LED: as LED1 on sheet [1]PowerSupply
Q4-Q7 = C1815: NPN 600mW, ECB; Value: C1815
R28-R40 = RM: Resistor SMD; Value: 1K
R72 = RM: Resistor SMD; Value: 1K
U4 = Sim holder: SIM Card Holder KF-016; pin to pad: 4>8 8>none

## Sheet [4]GNSS.SchDoc
size A
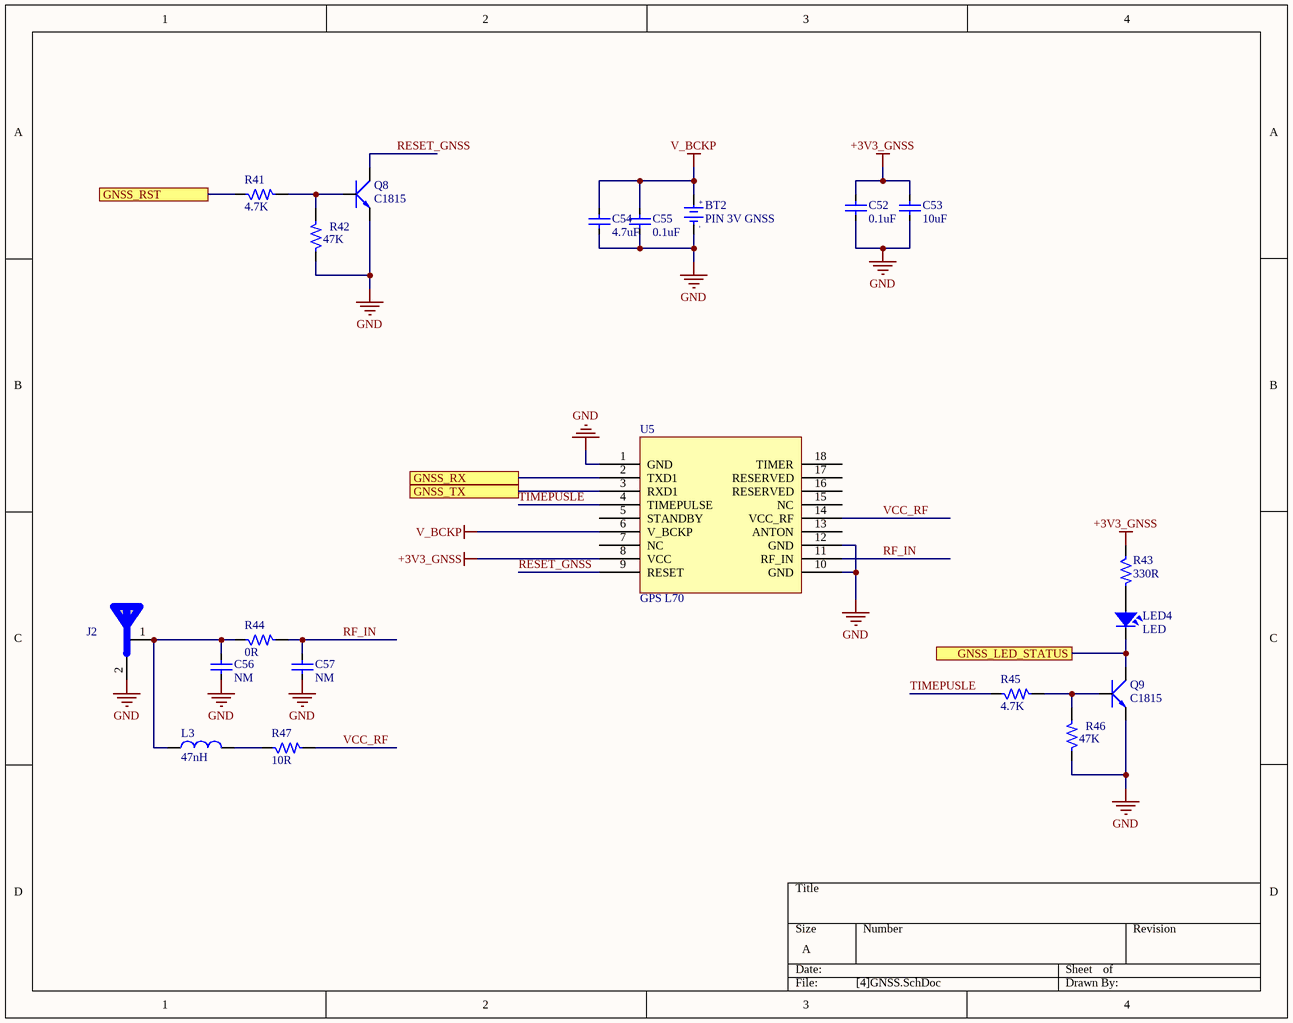
[diagram p4: [4]GNSS.SchDoc]

### Parts
BT2  PIN 3V GNSS  [CR1220 SMD]
C52  0.1uF  [CAP_0805]
C53  10uF  [CAP_0805]
C54  4.7uF  [CAP_0805]
C55  0.1uF  [CAP_0805]
C56  NM  [CAP_0805]
C57  NM  [CAP_0805]
J2  GPS_ANTENNA  [Antenna-MCX5.08-H5]  (value not drawn)
L3  47nH  [RES-SMD-0805]
LED4  LED  [LED-0805-Red]
Q8  C1815  [SOT23B]
Q9  C1815  [SOT23B]
R41  4.7K  [R0805]
R42  47K  [R0805]
R43  330R  [R0805]
R44  0R  [R0805]
R45  4.7K  [R0805]
R46  47K  [R0805]
R47  10R  [R0805]
U5  GPS L70  [GPS L70]

### Ports
GNSS_LED_STATUS, GNSS_RST, GNSS_RX, GNSS_TX

### Nets
+3V3_GNSS: C52.2 C53.2 R43.1 U5.8(VCC)
GND: BT2.2(GND) C52.1 C53.1 C54.1 C55.1 C56.1 C57.1 J2.2(GND) Q8.1(E) Q9.1(E) R42.1 R46.1 U5.1(GND) U5.10(GND) U5.12(GND)
V_BCKP: BT2.1(+3V) C54.2 C55.2 U5.6(V_BCKP)
RESET_GNSS: Q8.2(C) U5.9(RESET)
RF_IN: C57.2 R44.2 U5.11(RF_IN)
TIMEPUSLE: R45.1 U5.4(TIMEPULSE)
VCC_RF: R47.2 U5.14(VCC_RF)
NetC56_2: C56.2 J2.1(GND) L3.1 R44.1
NetD3_1: LED4.2 Q9.2(C) ; port GNSS_LED_STATUS
NetL3_2: L3.2 R47.1
NetLED4_1: LED4.1 R43.2
NetQ8_3: Q8.3(B) R41.2 R42.2
NetQ9_3: Q9.3(B) R45.2 R46.2
NetR41_1: R41.1 ; port GNSS_RST
NetU3_51: U5.3(RXD1) ; port GNSS_TX
NetU3_52: U5.2(TXD1) ; port GNSS_RX

Not connected (* = marked no-connect by the designer): U5 5(STANDBY) 7(NC) 13(ANTON) 15(NC) 16(RESERVED) 17(RESERVED) 18(TIMER)

### Notes on the sheet
- (in symbol PIN 3V) +; -

### Library data of the parts
BT2 = PIN 3V: Battery 3VDC; Value: PIN 3V
C52-C57 = CapSMD: Capacitor; Value: 33p; Published: 8-Jun-2000; LatestRevisionDate: 17-Jul-2002; LatestRevisionNote: Re-released for DXP Platform.; PackageReference: RAD-0.3; Publisher: Altium Limited
J2 = ANTEN
L3 = L1: Inductor; Value: 150 mH
LED4 = LED: as LED1 on sheet [1]PowerSupply
Q8 Q9 = C1815: NPN 600mW, ECB; Value: C1815
R41-R47 = RM: Resistor SMD; Value: 1K

## Sheet [5]Flash_SDCard.SchDoc
size A4
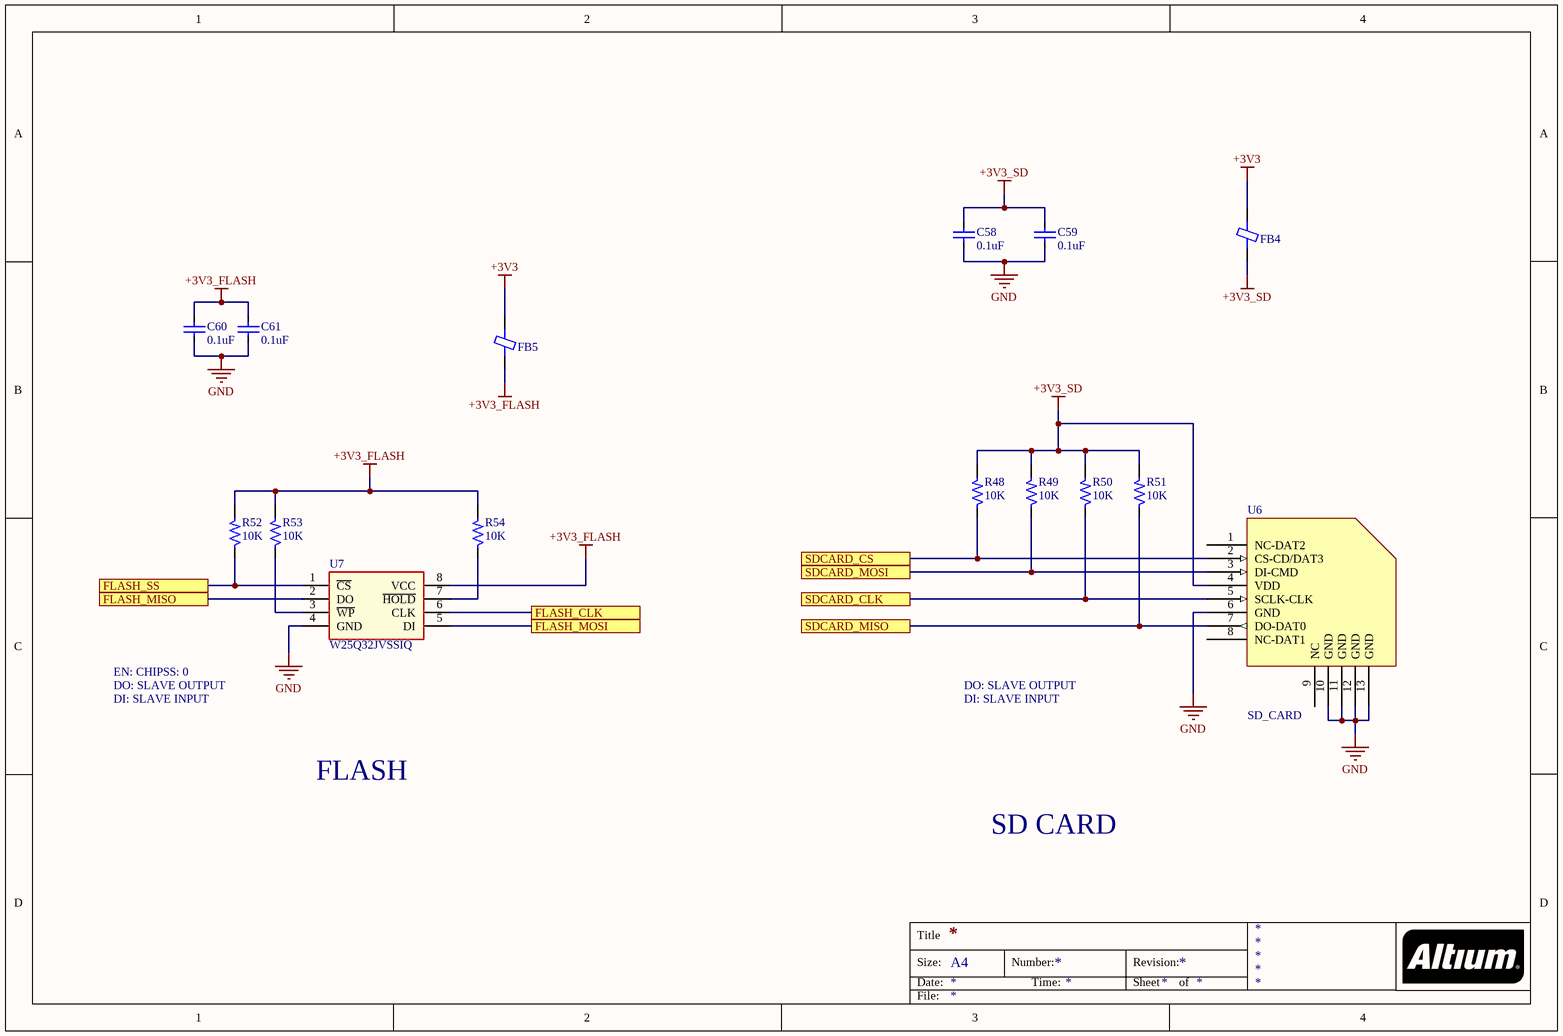
[diagram p5: [5]Flash_SDCard.SchDoc]

### Parts
C58  0.1uF  [CAP_0805]
C59  0.1uF  [CAP_0805]
C60  0.1uF  [CAP_0805]
C61  0.1uF  [CAP_0805]
FB4  120R  [RES-SMD-0805]  (value not drawn)
FB5  120R  [RES-SMD-0805]  (value not drawn)
R48  10K  [R0805]
R49  10K  [R0805]
R50  10K  [R0805]
R51  10K  [R0805]
R52  10K  [R0805]
R53  10K  [R0805]
R54  10K  [R0805]
U6  SD_CARD  [MICROSD2]
U7  W25Q32JVSSIQ  [SO-8 208]

### Ports
FLASH_CLK, FLASH_MISO, FLASH_MOSI, FLASH_SS, SDCARD_CLK, SDCARD_CS, SDCARD_MISO, SDCARD_MOSI

### Nets
+3V3: FB4.1 FB5.1
+3V3_FLASH: C60.2 C61.2 FB5.2 R52.2 R53.2 R54.2 U7.8(VCC)
+3V3_SD: C58.2 C59.2 FB4.2 R48.2 R49.2 R50.2 R51.2 U6.4(VDD)
GND: C58.1 C59.1 C60.1 C61.1 U6.6(GND) U6.10(GND) U6.11(GND) U6.12(GND) U6.13(GND) U7.4(GND)
NetR48_1: R48.1 U6.2(CS-CD/DAT3) ; port SDCARD_CS
NetR49_1: R49.1 U6.3(DI-CMD) ; port SDCARD_MOSI
NetR50_1: R50.1 U6.5(SCLK-CLK) ; port SDCARD_CLK
NetR51_1: R51.1 U6.7(DO-DAT0) ; port SDCARD_MISO
NetR52_1: R52.1 U7.1(~{CS}) ; port FLASH_SS
NetR53_1: R53.1 U7.3(~{WP})
NetR54_1: R54.1 U7.7(~{HOLD})
NetU3_34: U7.6(CLK) ; port FLASH_CLK
NetU3_35: U7.2(DO) ; port FLASH_MISO
NetU3_36: U7.5(DI) ; port FLASH_MOSI

Not connected (* = marked no-connect by the designer): U6 1(NC-DAT2) 8(NC-DAT1) 9(NC)

### Notes on the sheet
- EN: CHIPSS: 0
- DO: SLAVE OUTPUT
- DI: SLAVE INPUT
- FLASH
- SD CARD
- Title
- Size:
- Date:
- A4
- Number:
- Time:
- Revision:
- Sheet
- of
- File:

### Library data of the parts
C58-C61 = CapSMD: Capacitor; Value: 33p; Published: 8-Jun-2000; LatestRevisionDate: 17-Jul-2002; LatestRevisionNote: Re-released for DXP Platform.; PackageReference: RAD-0.3; Publisher: Altium Limited
FB4 FB5 = Ferrite beads
R48-R54 = RM: Resistor SMD; Value: 1K
U6 = MicroSD: SD/MMC holder
U7 = W25Q32JV: FLASH 32MBIT 133MHZ 8SOP

## Sheet [6]RS232_Debug.SchDoc
size A4
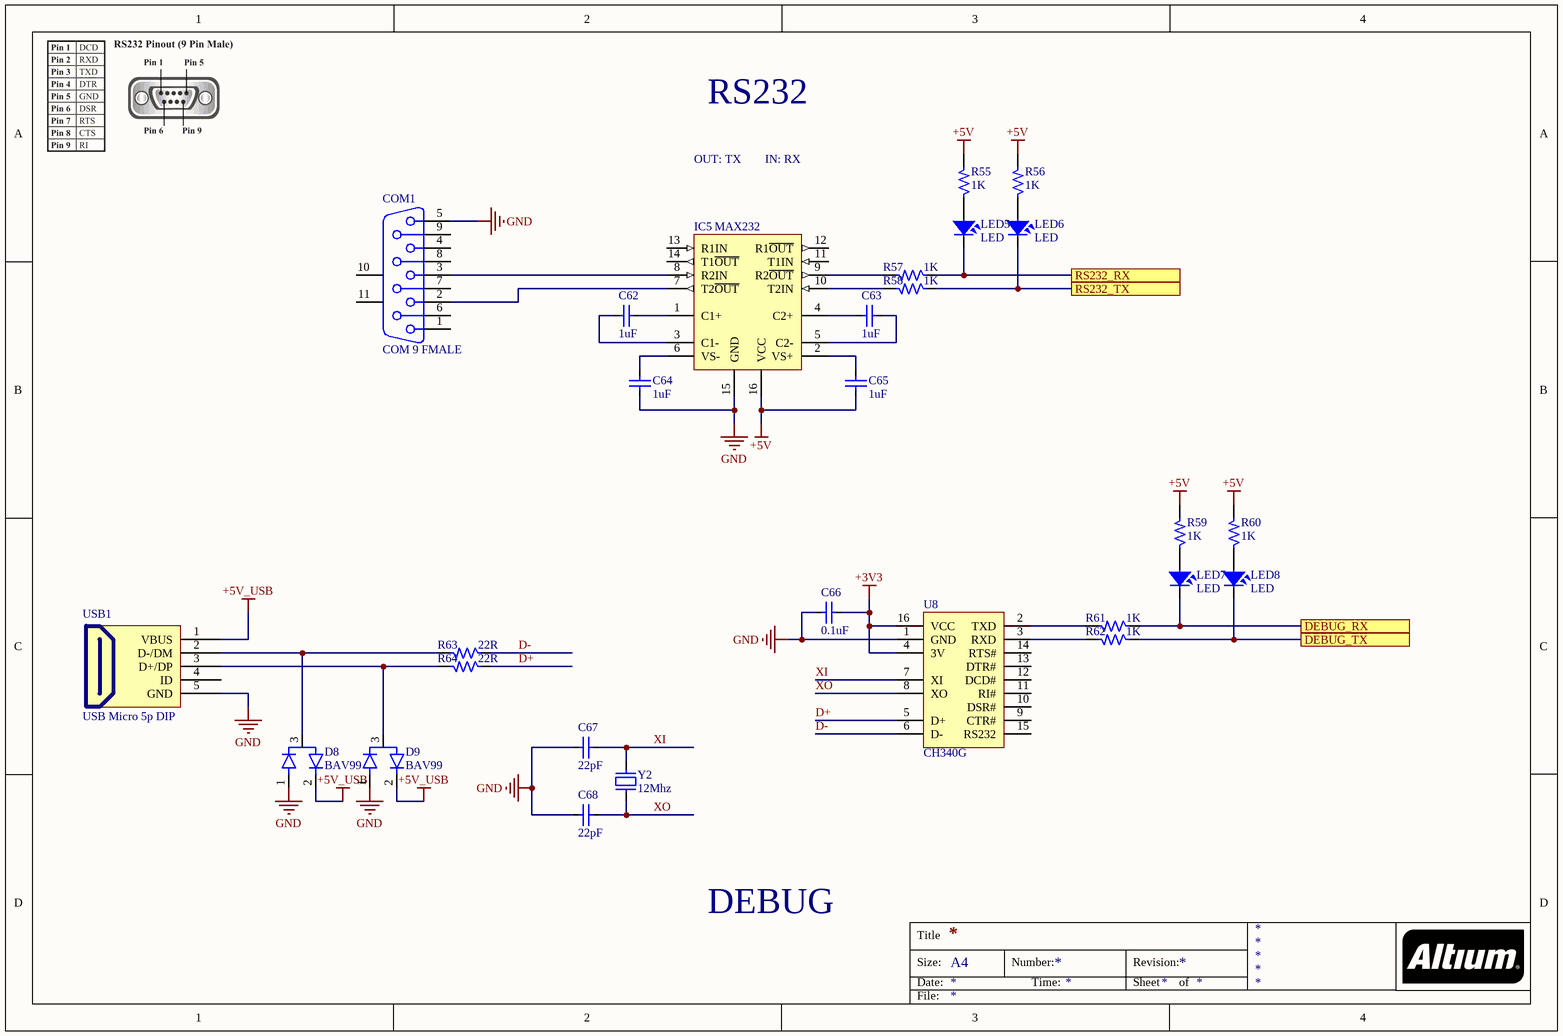
[diagram p6: [6]RS232_Debug.SchDoc]

### Parts
C62  1uF  [CAP_0805]
C63  1uF  [CAP_0805]
C64  1uF  [CAP_0805]
C65  1uF  [CAP_0805]
C66  0.1uF  [CAP_0805]
C67  22pF  [CAP_0805]
C68  22pF  [CAP_0805]
COM1  COM 9 FMALE  [DSB 9-F]
D8  BAV99  [DIO_BAV99]
D9  BAV99  [DIO_BAV99]
IC5  MAX232  [MAX232DR]
LED5  LED  [LED-0805-Blue]
LED6  LED  [LED-0805-Blue]
LED7  LED  [LED-0805-Blue]
LED8  LED  [LED-0805-Blue]
R55  1K  [R0805]
R56  1K  [R0805]
R57  1K  [R0805]
R58  1K  [R0805]
R59  1K  [R0805]
R60  1K  [R0805]
R61  1K  [R0805]
R62  1K  [R0805]
R63  22R  [R0805]
R64  22R  [R0805]
U8  CH340G  [SO16]
USB1  USB Micro 5p DIP  [USB Micro 5p DIP]
Y2  12Mhz  [Thach Anh 2 chan SMD5032]

### Ports
DEBUG_RX, DEBUG_TX, RS232_RX, RS232_TX

### Nets
+3V3: C66.1 U8.4(3V) U8.16(VCC)
+5V: C65.2 IC5.16(VCC) R55.2 R56.2 R59.2 R60.2
+5V_USB: D8.2 D9.2 USB1.1(VBUS)
GND: C64.2 C66.2 C67.2 C68.2 COM1.5 D8.1 D9.1 IC5.15(GND) U8.1(GND) USB1.5(GND)
D+: R64.1 U8.5(D+)
D-: R63.1 U8.6(D-)
XI: C67.1 U8.7(XI) Y2.1
XO: C68.1 U8.8(XO) Y2.2
NetC62_1: C62.1 IC5.1(C1+)
NetC62_2: C62.2 IC5.3(C1-)
NetC63_1: C63.1 IC5.5(C2-)
NetC63_2: C63.2 IC5.4(C2+)
NetC64_1: C64.1 IC5.6(VS-)
NetC65_1: C65.1 IC5.2(VS+)
NetCOM1_2: COM1.2 IC5.7(T2~{OUT})
NetCOM1_3: COM1.3 IC5.8(R2IN)
NetD8_3: D8.3 R63.2 USB1.2(D-/DM)
NetD9_3: D9.3 R64.2 USB1.3(D+/DP)
NetIC5_9: IC5.9(R2~{OUT}) R57.2
NetIC5_10: IC5.10(T2IN) R58.2
NetLED5_1: LED5.1 R55.1
NetLED5_2: LED5.2 R57.1 ; port RS232_RX
NetLED6_1: LED6.1 R56.1
NetLED6_2: LED6.2 R58.1 ; port RS232_TX
NetLED7_1: LED7.1 R59.1
NetLED7_2: LED7.2 R61.1 ; port DEBUG_RX
NetLED8_1: LED8.1 R60.1
NetLED8_2: LED8.2 R62.1 ; port DEBUG_TX
NetR61_2: R61.2 U8.2(TXD)
NetR62_2: R62.2 U8.3(RXD)

Not connected (* = marked no-connect by the designer): COM1 1 4 6 7 8 9 10(MH1) 11(MH2); IC5 11(T1IN) 12(R1~{OUT}) 13(R1IN) 14(T1~{OUT}); U8 9(CTR#) 10(DSR#) 11(RI#) 12(DCD#) 13(DTR#) 14(RTS#) 15(RS232); USB1 4(ID)

### Notes on the sheet
- RS232
- OUT: TX        IN: RX
- DEBUG
- Title
- Size:
- Date:
- A4
- Number:
- Time:
- Revision:
- Sheet
- of
- File:

### Library data of the parts
C62-C68 = CapSMD: Capacitor; Value: 33p; Published: 8-Jun-2000; LatestRevisionDate: 17-Jul-2002; LatestRevisionNote: Re-released for DXP Platform.; PackageReference: RAD-0.3; Publisher: Altium Limited
COM1 = DSB9F: COM 9; PackageDocument: O; Positions: 9; Gender: Receptacle; Value: COM 9; Published: 15-Jun-2001; LatestRevisionDate: 17-Jul-2002; LatestRevisionNote: Re-released for DXP Platform.; DatasheetDocument: 1-Sep-1999; PackageReference: 788750; Publisher: Altium Limited; Orientation: Right Angle
D8 D9 = BAV99: as D4 on sheet [2]MCU; Price: None; Availability: In Stock; MP: BAV99; Package: SOT-23-3 Motorola; SnapEDA_Link: https://www.snapeda.com/parts/BAV99/Onsemi/view-part/?ref=snap; Check_prices: https://www.snapeda.com/parts/BAV99/Onsemi/view-part/?ref=eda; Value: *; Purchase-URL: https://pricing.snapeda.com/search/part/BAV99/?ref=eda
IC5 = MAX232: Dual EIA-232 Driver/Receiver; Value: MAX232
LED5-LED8 = LED: as LED1 on sheet [1]PowerSupply
R55-R62 = RM: Resistor SMD; Value: 1K
R63 R64 = RM: Resistor SMD; Value: 1K
U8 = CH340G: High and Low Side Driver; Note: Pins 4, 8 and 14 are not connected; Published: 8-Jun-2000; LatestRevisionDate: 04-Mar-2005; LatestRevisionNote: Stylized 3D Model Added.; DatasheetVersion: PD60147J; PackageReference: PDIP14; Publisher: Altium Limited; PackageDescription: DIP; 14 Leads; Row Spacing 7.62 mm; Pitch 2.54 mm; ComponentLink1Description: Manufacturer Link; ComponentLink1URL: http://www.irf.com/; ComponentLink2Description: Datasheet; ComponentLink2URL: http://www.irf.com/product-info/datasheets/data/ir2110.pdf
USB1 = USB Micro 5p DIP: USB Type B; Ten: MicroUSB MK5P DIP; Ma_Hang: MH005145
Y2 = Thach Anh 2 chan SMD 5032: Crystal For all Crystal 2pin.; Value: 4Mhz

## Sheet [7]RFID_OLED.SchDoc
size A4
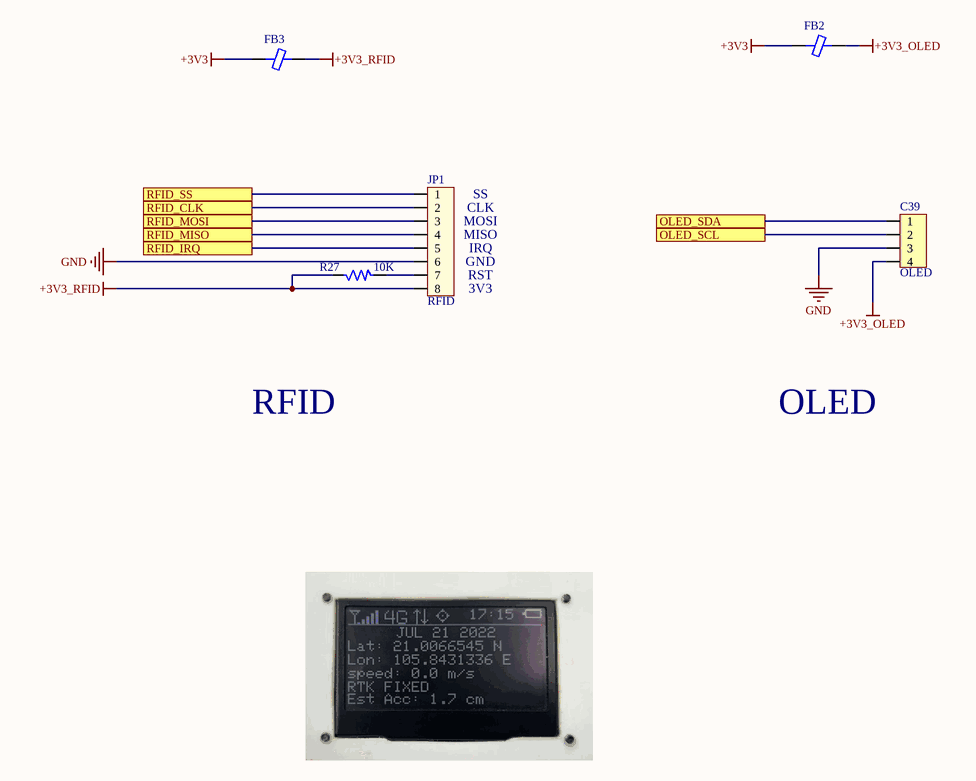
[diagram p7: [7]RFID_OLED.SchDoc]

### Parts
C39  OLED  [CON_4P]
FB2  120R  [RES-SMD-0805]  (value not drawn)
FB3  120R  [RES-SMD-0805]  (value not drawn)
JP1  RFID  [CON_8P]
R27  10K  [R0805]

### Ports
OLED_SCL, OLED_SDA, RFID_CLK, RFID_IRQ, RFID_MISO, RFID_MOSI, RFID_SS

### Nets
+3V3: FB2.1 FB3.1
+3V3_OLED: C39.4 FB2.2
+3V3_RFID: FB3.2 JP1.8 R27.1
GND: C39.3 JP1.6
NetC39_1: C39.1 ; port OLED_SDA
NetC39_2: C39.2 ; port OLED_SCL
NetJP1_1: JP1.1 ; port RFID_SS
NetJP1_2: JP1.2 ; port RFID_CLK
NetJP1_3: JP1.3 ; port RFID_MOSI
NetJP1_4: JP1.4 ; port RFID_MISO
NetJP1_5: JP1.5 ; port RFID_IRQ
NetJP1_7: JP1.7 R27.2

### Notes on the sheet
- (near JP1) SS
- (near JP1) CLK
- (near JP1) MOSI
- (near JP1) MISO
- (near JP1) IRQ
- (near JP1) GND
- (near JP1) RST
- (near JP1) 3V3
- RFID
- OLED
- Title
- Size:
- Date:
- A4
- Number:
- Time:
- Revision:
- Sheet
- of
- File:

### Library data of the parts
C39 = Header4: as C31 on sheet [2]MCU; Created Date: 29 March 2013; ComponentLink1URL: http://www.we-online.com; ComponentLink2URL: http://katalog.we-online.de/em/datasheet/6130xx143121.pdf; Created by: Karrer Zheng
FB2 FB3 = Ferrite beads
JP1 = Con8: Connector 8; Value: Connector 8
R27 = RM: Resistor SMD; Value: 1K

## Sheet [8]Sensors.SchDoc
size A4
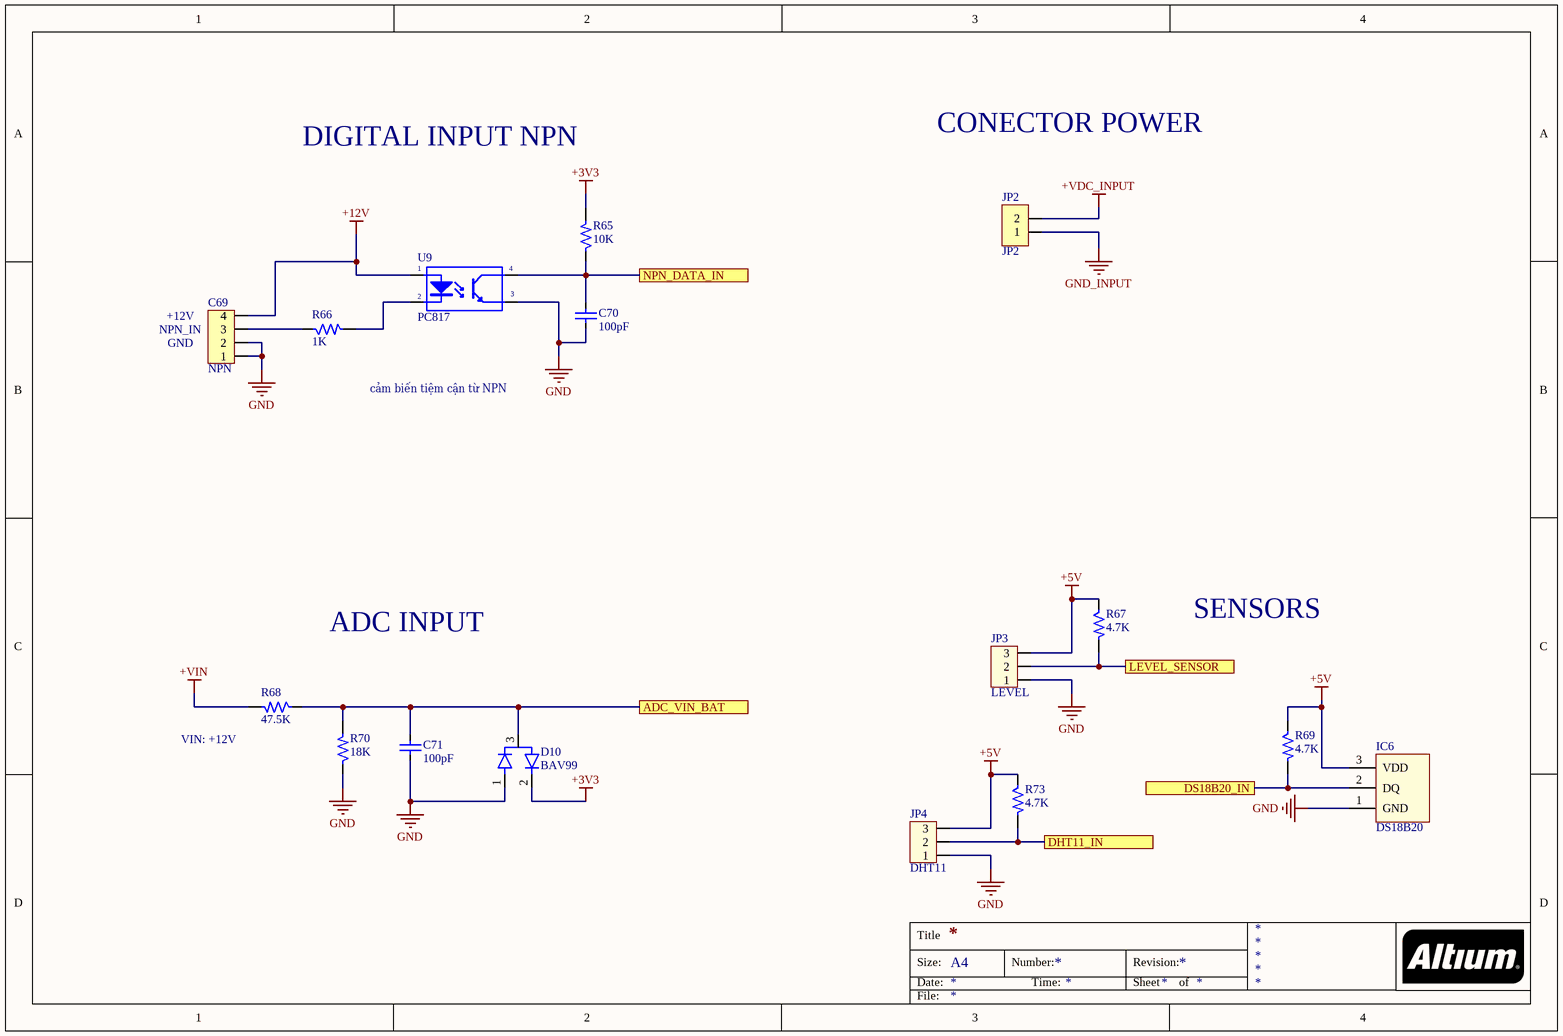
[diagram p8: [8]Sensors.SchDoc]

### Parts
C69  NPN  [CON_4P]
C70  100pF  [CAP_0805]
C71  100pF  [CAP_0805]
D10  BAV99  [DIO_BAV99]
IC6  DS18B20  [DS18S20]
JP2  JP2  [JP2-C1T]
JP3  LEVEL  [CON3]
JP4  DHT11  [CON3]
R65  10K  [R0805]
R66  1K  [R0805]
R67  4.7K  [R0805]
R68  47.5K  [R0805]
R69  4.7K  [R0805]
R70  18K  [R0805]
R73  4.7K  [R0805]
U9  PC817  [SOT254P975X400-4N]

### Ports
ADC_VIN_BAT, DHT11_IN, DS18B20_IN, LEVEL_SENSOR, NPN_DATA_IN

### Nets
+3V3: D10.2 R65.2
+5V: IC6.3(VDD) JP3.3 JP4.3 R67.1 R69.1 R73.1
+12V: C69.4 U9.1(A)
+VDC_INPUT: JP2.2
+VIN: R68.2
GND: C69.1 C69.2 C70.2 C71.2 D10.1 IC6.1(GND) JP3.1 JP4.1 R70.1 U9.3(E)
GND_INPUT: JP2.1
NetC69_3: C69.3 R66.1
NetC70_1: C70.1 R65.1 U9.4(C) ; port NPN_DATA_IN
NetC71_1: C71.1 D10.3 R68.1 R70.2 ; port ADC_VIN_BAT
NetIC6_2: IC6.2(DQ) R69.2 ; port DS18B20_IN
NetJP3_2: JP3.2 R67.2 ; port LEVEL_SENSOR
NetJP4_2: JP4.2 R73.2 ; port DHT11_IN
NetR66_2: R66.2 U9.2(K)

### Notes on the sheet
- DIGITAL INPUT NPN
- CONECTOR POWER
- (near C69) +12V
- (near C69) NPN_IN
- (near C69) GND
- cảm biến tiệm cận từ NPN
- ADC INPUT
- SENSORS
- (near R68) VIN: +12V
- Title
- Size:
- Date:
- A4
- Number:
- Time:
- Revision:
- Sheet
- of
- File:

### Library data of the parts
C69 = Header4: as C31 on sheet [2]MCU; Created Date: 29 March 2013; ComponentLink1URL: http://www.we-online.com; ComponentLink2URL: http://katalog.we-online.de/em/datasheet/6130xx143121.pdf; Created by: Karrer Zheng
C70 C71 = CapSMD: Capacitor; Value: 33p; Published: 8-Jun-2000; LatestRevisionDate: 17-Jul-2002; LatestRevisionNote: Re-released for DXP Platform.; PackageReference: RAD-0.3; Publisher: Altium Limited
D10 = BAV99: as D4 on sheet [2]MCU; Price: None; Availability: In Stock; MP: BAV99; Package: SOT-23-3 Motorola; SnapEDA_Link: https://www.snapeda.com/parts/BAV99/Onsemi/view-part/?ref=snap; Check_prices: https://www.snapeda.com/parts/BAV99/Onsemi/view-part/?ref=eda; Value: *; Purchase-URL: https://pricing.snapeda.com/search/part/BAV99/?ref=eda
IC6 = DS18S20: High Precision  1-Wire® Digital Thermometer; pin to pad: 1>5 2>4
JP2 = JP2: WR-PHD 2.54 mm Angled Socket Header; Manufacturer: W¨¹rth Elektronik eiSos GmbH; partNo: 613002143121; ComponentLink1 Description: Manufacturer; ComponentLink2 Description: Datasheet; NoPins: 02; Created Date: 29 March 2013; ComponentLink1URL: http://www.we-online.com; ComponentLink2URL: http://katalog.we-online.de/em/datasheet/6130xx143121.pdf; Created by: Karrer Zheng
JP3 JP4 = Con3: Connector 3; Value: Connector 3
R65 R67-R70 R73 = RM: Resistor SMD; Value: 1K
R66 = RM: Resistor SMD; Value: 1K
U9 = PC817: Single Opto; Value: PC817

## Sheet [0]Abstract.SchDoc
size A3

### Notes on the sheet
- Title
- Size:
- Date:
- A3
- Number:
- Time:
- Revision:
- Sheet
- of
- File:
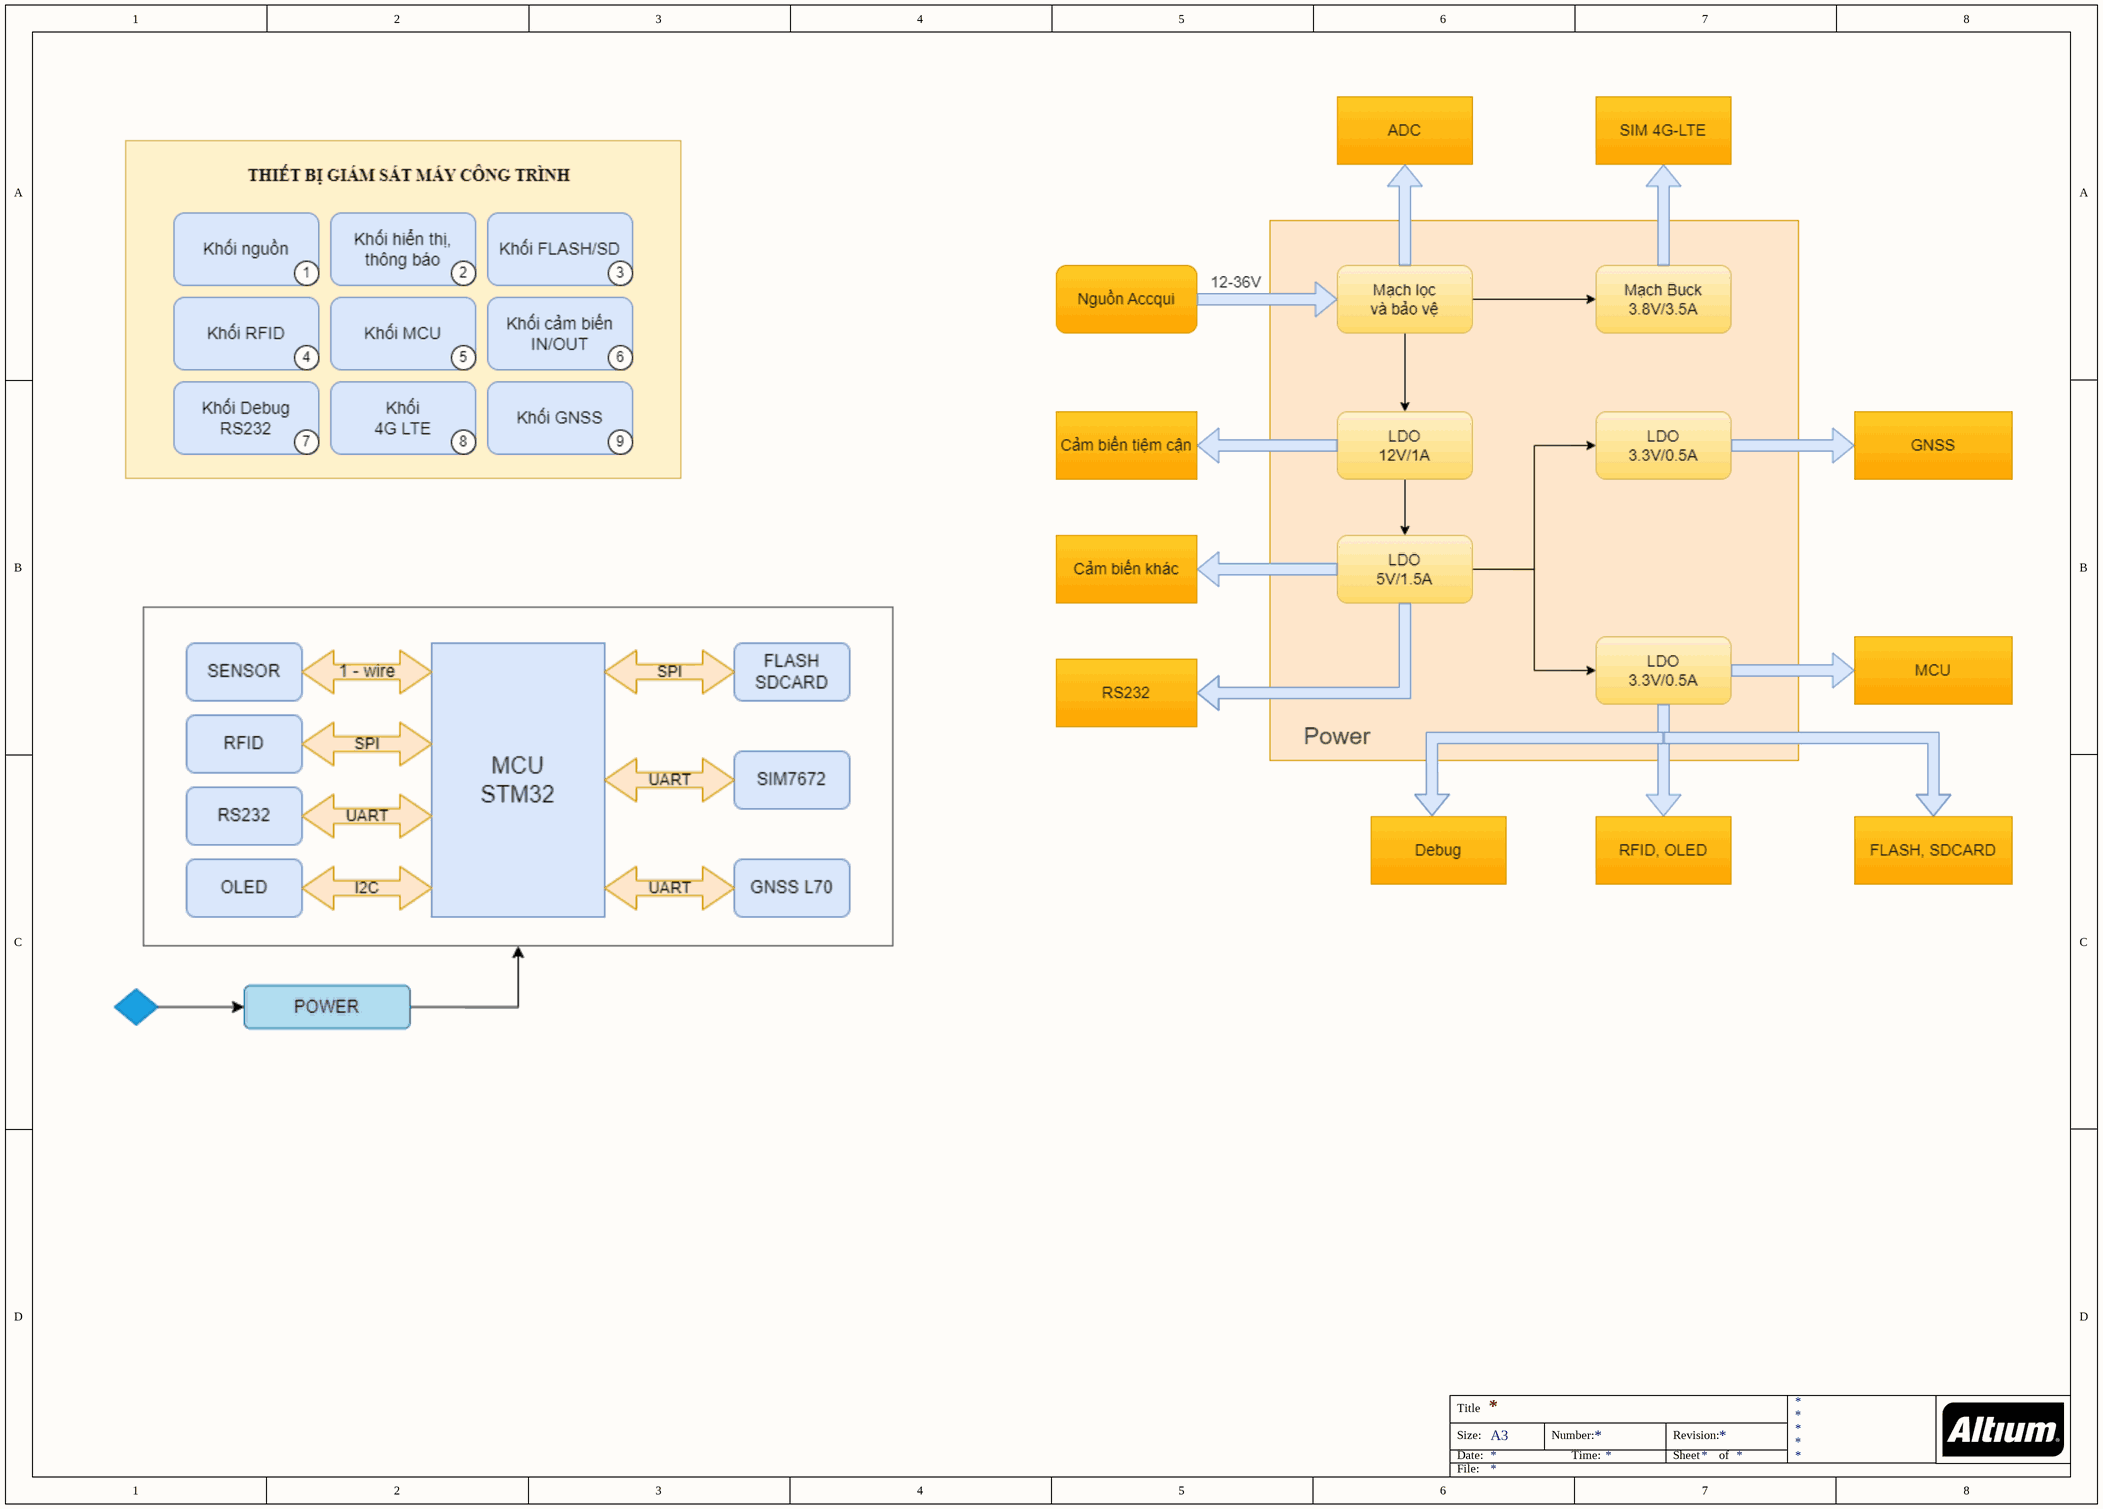
[diagram p9: [0]Abstract.SchDoc]

## Nets that join several sheets
+3V3: [2]MCU (FB1.1), [1]PowerSupply (C16.2 IC1.5), [3]4G (C41.2 IC4.7), [5]Flash_SDCard (FB4.1 FB5.1), [6]RS232_Debug (C66.1 U8.4 U8.16), [7]RFID_OLED (FB2.1 FB3.1), [8]Sensors (D10.2 R65.2)
+3V3_GNSS: [1]PowerSupply (C18.2 IC2.5), [4]GNSS (C52.2 C53.2 R43.1 U5.8)
+3V8_4G: [2]MCU (R17.1), [1]PowerSupply (5 pins), [3]4G (8 pins)
+5V: [1]PowerSupply (11 pins), [6]RS232_Debug (6 pins), [8]Sensors (6 pins)
+12V: [1]PowerSupply (5 pins), [8]Sensors (C69.4 U9.1)
+VDC_INPUT: [1]PowerSupply (F1.1), [8]Sensors (JP2.2)
+VIN: [1]PowerSupply (8 pins), [8]Sensors (R68.2)
GND: [2]MCU (34 pins), [1]PowerSupply (33 pins), [3]4G (46 pins), [4]GNSS (15 pins), [5]Flash_SDCard (10 pins), [6]RS232_Debug (10 pins), [7]RFID_OLED (C39.3 JP1.6), [8]Sensors (10 pins)
GND_INPUT: [1]PowerSupply (C5.1 L1.1), [8]Sensors (JP2.1)
NetC39_1: [2]MCU (U3.59), [7]RFID_OLED (C39.1)
NetC39_2: [2]MCU (U3.58), [7]RFID_OLED (C39.2)
NetC70_1: [2]MCU (U3.8), [8]Sensors (C70.1 R65.1 U9.4)
NetC71_1: [2]MCU (U3.9), [8]Sensors (C71.1 D10.3 R68.1 R70.2)
NetD3_1: [2]MCU (D3.1), [4]GNSS (LED4.2 Q9.2)
NetD3_3: [2]MCU (D3.3), [3]4G (Q6.2)
NetIC4_1: [2]MCU (U3.42), [3]4G (IC4.1)
NetIC4_8: [2]MCU (U3.43), [3]4G (IC4.8)
NetIC6_2: [2]MCU (U3.11), [8]Sensors (IC6.2 R69.2)
NetJP1_1: [2]MCU (U3.20), [7]RFID_OLED (JP1.1)
NetJP1_2: [2]MCU (U3.21), [7]RFID_OLED (JP1.2)
NetJP1_3: [2]MCU (U3.23), [7]RFID_OLED (JP1.3)
NetJP1_4: [2]MCU (U3.22), [7]RFID_OLED (JP1.4)
NetJP1_5: [2]MCU (U3.14), [7]RFID_OLED (JP1.5)
NetJP3_2: [2]MCU (U3.10), [8]Sensors (JP3.2 R67.2)
NetJP4_2: [2]MCU (U3.24), [8]Sensors (JP4.2 R73.2)
NetLED5_2: [2]MCU (U3.17), [6]RS232_Debug (LED5.2 R57.1)
NetLED6_2: [2]MCU (U3.16), [6]RS232_Debug (LED6.2 R58.1)
NetLED7_2: [2]MCU (U3.54), [6]RS232_Debug (LED7.2 R61.1)
NetLED8_2: [2]MCU (U3.53), [6]RS232_Debug (LED8.2 R62.1)
NetR7_2: [2]MCU (U3.44), [1]PowerSupply (R7.2)
NetR11_2: [2]MCU (U3.39), [1]PowerSupply (R11.2)
NetR28_1: [2]MCU (U3.50), [3]4G (R28.1)
NetR34_1: [2]MCU (U3.45), [3]4G (R34.1)
NetR41_1: [2]MCU (U3.40), [4]GNSS (R41.1)
NetR48_1: [2]MCU (U3.27), [5]Flash_SDCard (R48.1 U6.2)
NetR49_1: [2]MCU (U3.57), [5]Flash_SDCard (R49.1 U6.3)
NetR50_1: [2]MCU (U3.55), [5]Flash_SDCard (R50.1 U6.5)
NetR51_1: [2]MCU (U3.56), [5]Flash_SDCard (R51.1 U6.7)
NetR52_1: [2]MCU (U3.33), [5]Flash_SDCard (R52.1 U7.1)
NetR72_2: [2]MCU (U3.41), [3]4G (R72.2)
NetU3_34: [2]MCU (U3.34), [5]Flash_SDCard (U7.6)
NetU3_35: [2]MCU (U3.35), [5]Flash_SDCard (U7.2)
NetU3_36: [2]MCU (U3.36), [5]Flash_SDCard (U7.5)
NetU3_51: [2]MCU (U3.51), [4]GNSS (U5.3)
NetU3_52: [2]MCU (U3.52), [4]GNSS (U5.2)